# EAGLE schematic ACU rev2 (EAGLE 9.6.2)

## Sheet 1 of 5
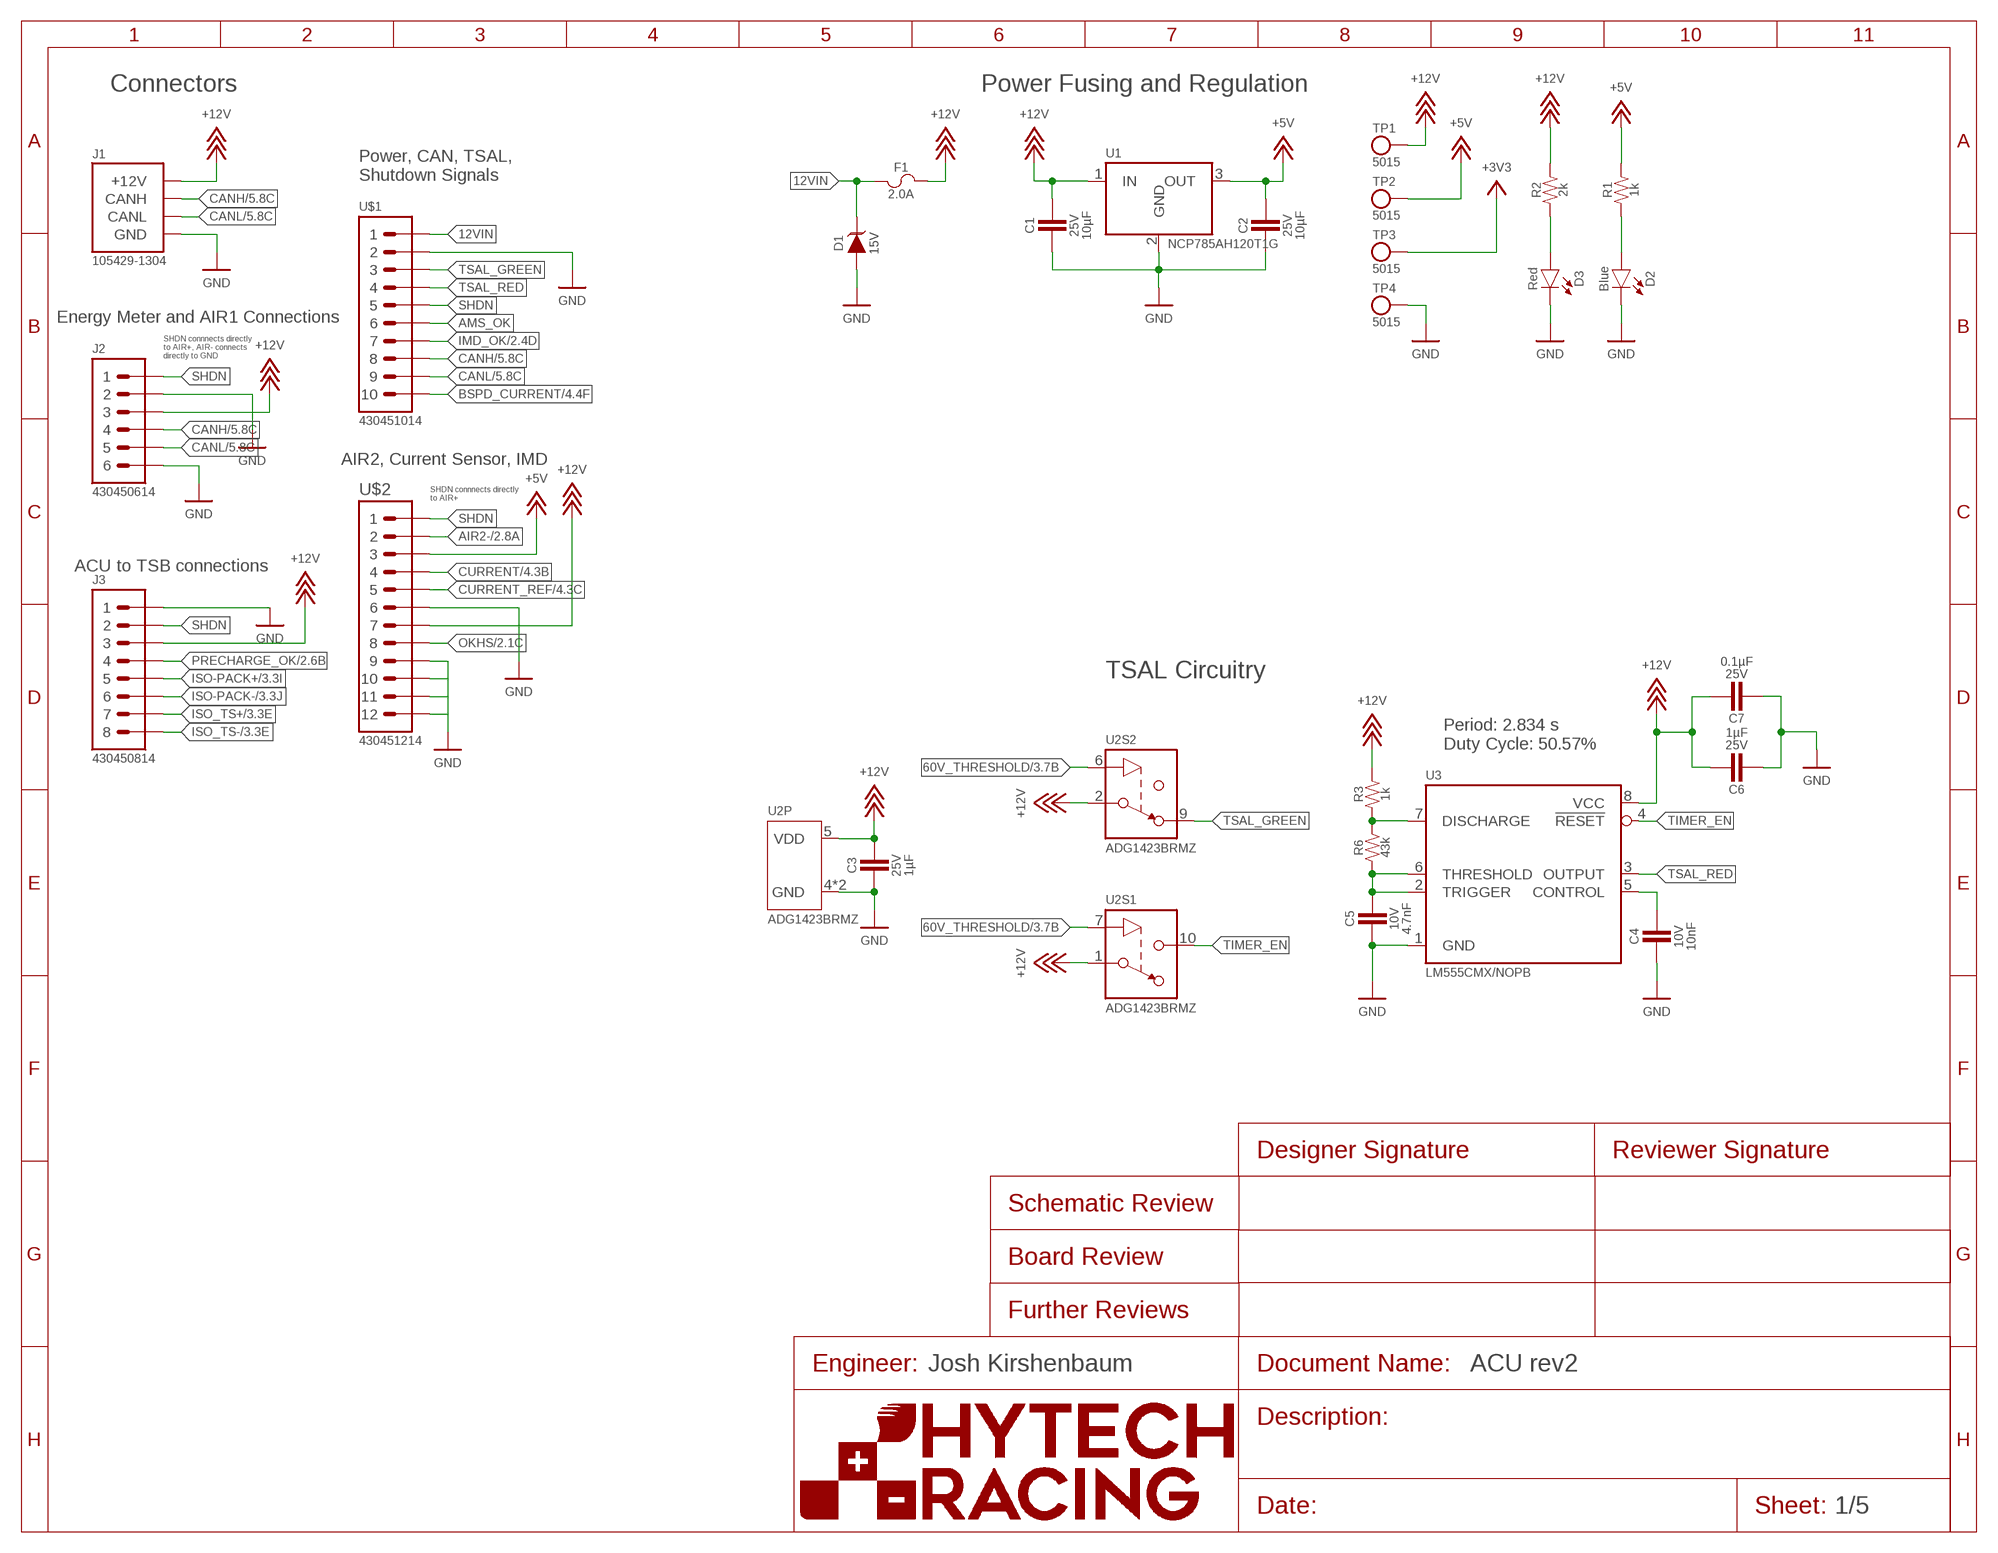
[diagram p0: schematic, sheet 1]

### Parts
C1  CAPACITOR_0603_25V_10UF  [0603-CAP]
C2  CAPACITOR_0603_25V_10UF  [0603-CAP]
C3  CAPACITOR_0603_25V_1UF  [0603-CAP]
C4  CAPACITOR_0603_10V_10NF  [0603-CAP]
C5  CAPACITOR_0603_10V_4.7NF  [0603-CAP]
C6  CAPACITOR_0603_25V_1UF  [0603-CAP]
C7  CAPACITOR_0603_25V_0.1UF  [0603-CAP]
D1  TVS_15V  [SOT-23]
D2  LED_0603_BLUE  [0603-LED]
D3  LED_0603_RED  [0603-LED]
F1  FUSE_0885_2.0  [0885]
J1  CONNECTOR-CAN_NF_T_V_BLACK  [MOLEX_NANOFIT_PTH_04]
J2  CONNECTOR-6_MF_T_V_  [MOLEX_MICROFIT_PTH_VERTICAL_06_DUAL]
J3  CONNECTOR-8_MF_T_V_  [MOLEX_MICROFIT_PTH_VERTICAL_08_DUAL]
R1  RESISTOR_0603_1K  [0603-RES]
R2  RESISTOR_0603_2K  [0603-RES]
R3  RESISTOR_0603_1K  [0603-RES]
R6  RESISTOR_0603_43K  [0603-RES]
TP1  TEST_POINT  [MICRO_MINIATURE]
TP2  TEST_POINT  [MICRO_MINIATURE]
TP3  TEST_POINT  [MICRO_MINIATURE]
TP4  TEST_POINT  [MICRO_MINIATURE]
U1  VOLTAGE_REGULATOR_SOT89_12V  [SOT89]
U2  ADG1423  [MSOP-10]
U3  LM555  [SOIC-08(NARROW,0.15")]
U$1  CONNECTOR-10_MF_T_V_  [MOLEX_MICROFIT_PTH_VERTICAL_10_DUAL]
U$2  CONNECTOR-12_MF_T_V_  [MOLEX_MICROFIT_PTH_VERTICAL_12_DUAL]

### Nets
12VIN: D1.3(C) F1.1 U$1.1
60V_THRESHOLD: U2.6(S2:IN) U2.7(S1:IN) ; also sheet 3
+5V: C2.1 R1.2 TP2.1 U1.3(OUT) U$2.3 ; also sheet 3,4,5
+12V: C1.1 C3.1 C6.1 C7.1 F1.2 J1.1(+12V) J2.3 J3.3 R2.2 R3.2 TP1.1 U1.1(IN) U2.1(S1:S) U2.2(S2:S) U2.5(P:VDD) U3.8(VCC) U$2.7 ; also sheet 2,4,5
AIR2-: U$2.2 ; also sheet 2
AMS_OK: U$1.6
BSPD_CURRENT: U$1.10 ; also sheet 4,5
CANH: J1.4(CANH) J2.4 U$1.8 ; also sheet 5
CANL: J1.3(CANL) J2.5 U$1.9 ; also sheet 5
CURRENT: U$2.4 ; also sheet 4
CURRENT_REF: U$2.5 ; also sheet 4
GND: C1.2 C2.2 C3.2 C4.2 C5.2 C6.2 C7.2 D1.1(A) D2.1(C) D3.1(C) J1.2(GND) J2.2 J2.6 J3.1 TP4.1 U1.2(GND) U2.4(P:GND) U2.8(P:GND) U3.1(GND) U$1.2 U$2.6 U$2.9 ; also sheet 2,3,4,5
IMD_OK: U$1.7 ; also sheet 2,5
ISO-PACK+: J3.5 ; also sheet 3
ISO-PACK-: J3.6 ; also sheet 3
ISO_TS+: J3.7 ; also sheet 3
ISO_TS-: J3.8 ; also sheet 3
N$1: D3.2(A) R2.1
N$2: D2.2(A) R1.1
N$3: C5.1 R6.1 U3.2(TRIGGER) U3.6(THRESHOLD)
N$4: TP3.1 ; supply symbol labelled +3V3
N$5: C4.1 U3.5(CONTROL)
N$6: R3.1 R6.2 U3.7(DISCHARGE)
N$19: U$2.12
N$20: U$2.11
N$21: U$2.10
OKHS: U$2.8 ; also sheet 2
PRECHARGE_OK: J3.4 ; also sheet 2,3,5
SHDN: J2.1 J3.2 U$1.5 U$2.1
TIMER_EN: U2.10(S1:D) U3.4(!RESET)
TSAL_GREEN: U2.9(S2:D) U$1.3
TSAL_RED: U3.3(OUTPUT) U$1.4

### Notes on the sheet
- Connectors | Power Fusing and Regulation
- Power, CAN, TSAL, 
  Shutdown Signals
- Energy Meter and AIR1 Connections
- SHDN connnects directly
  to AIR+, AIR- connects
  directly to GND
- AIR2, Current Sensor, IMD
- SHDN connnects directly
  to AIR+
- ACU to TSB connections
- TSAL Circuitry
- Period: 2.834 s
  Duty Cycle: 50.57%
- Josh Kirshenbaum

## Sheet 2 of 5
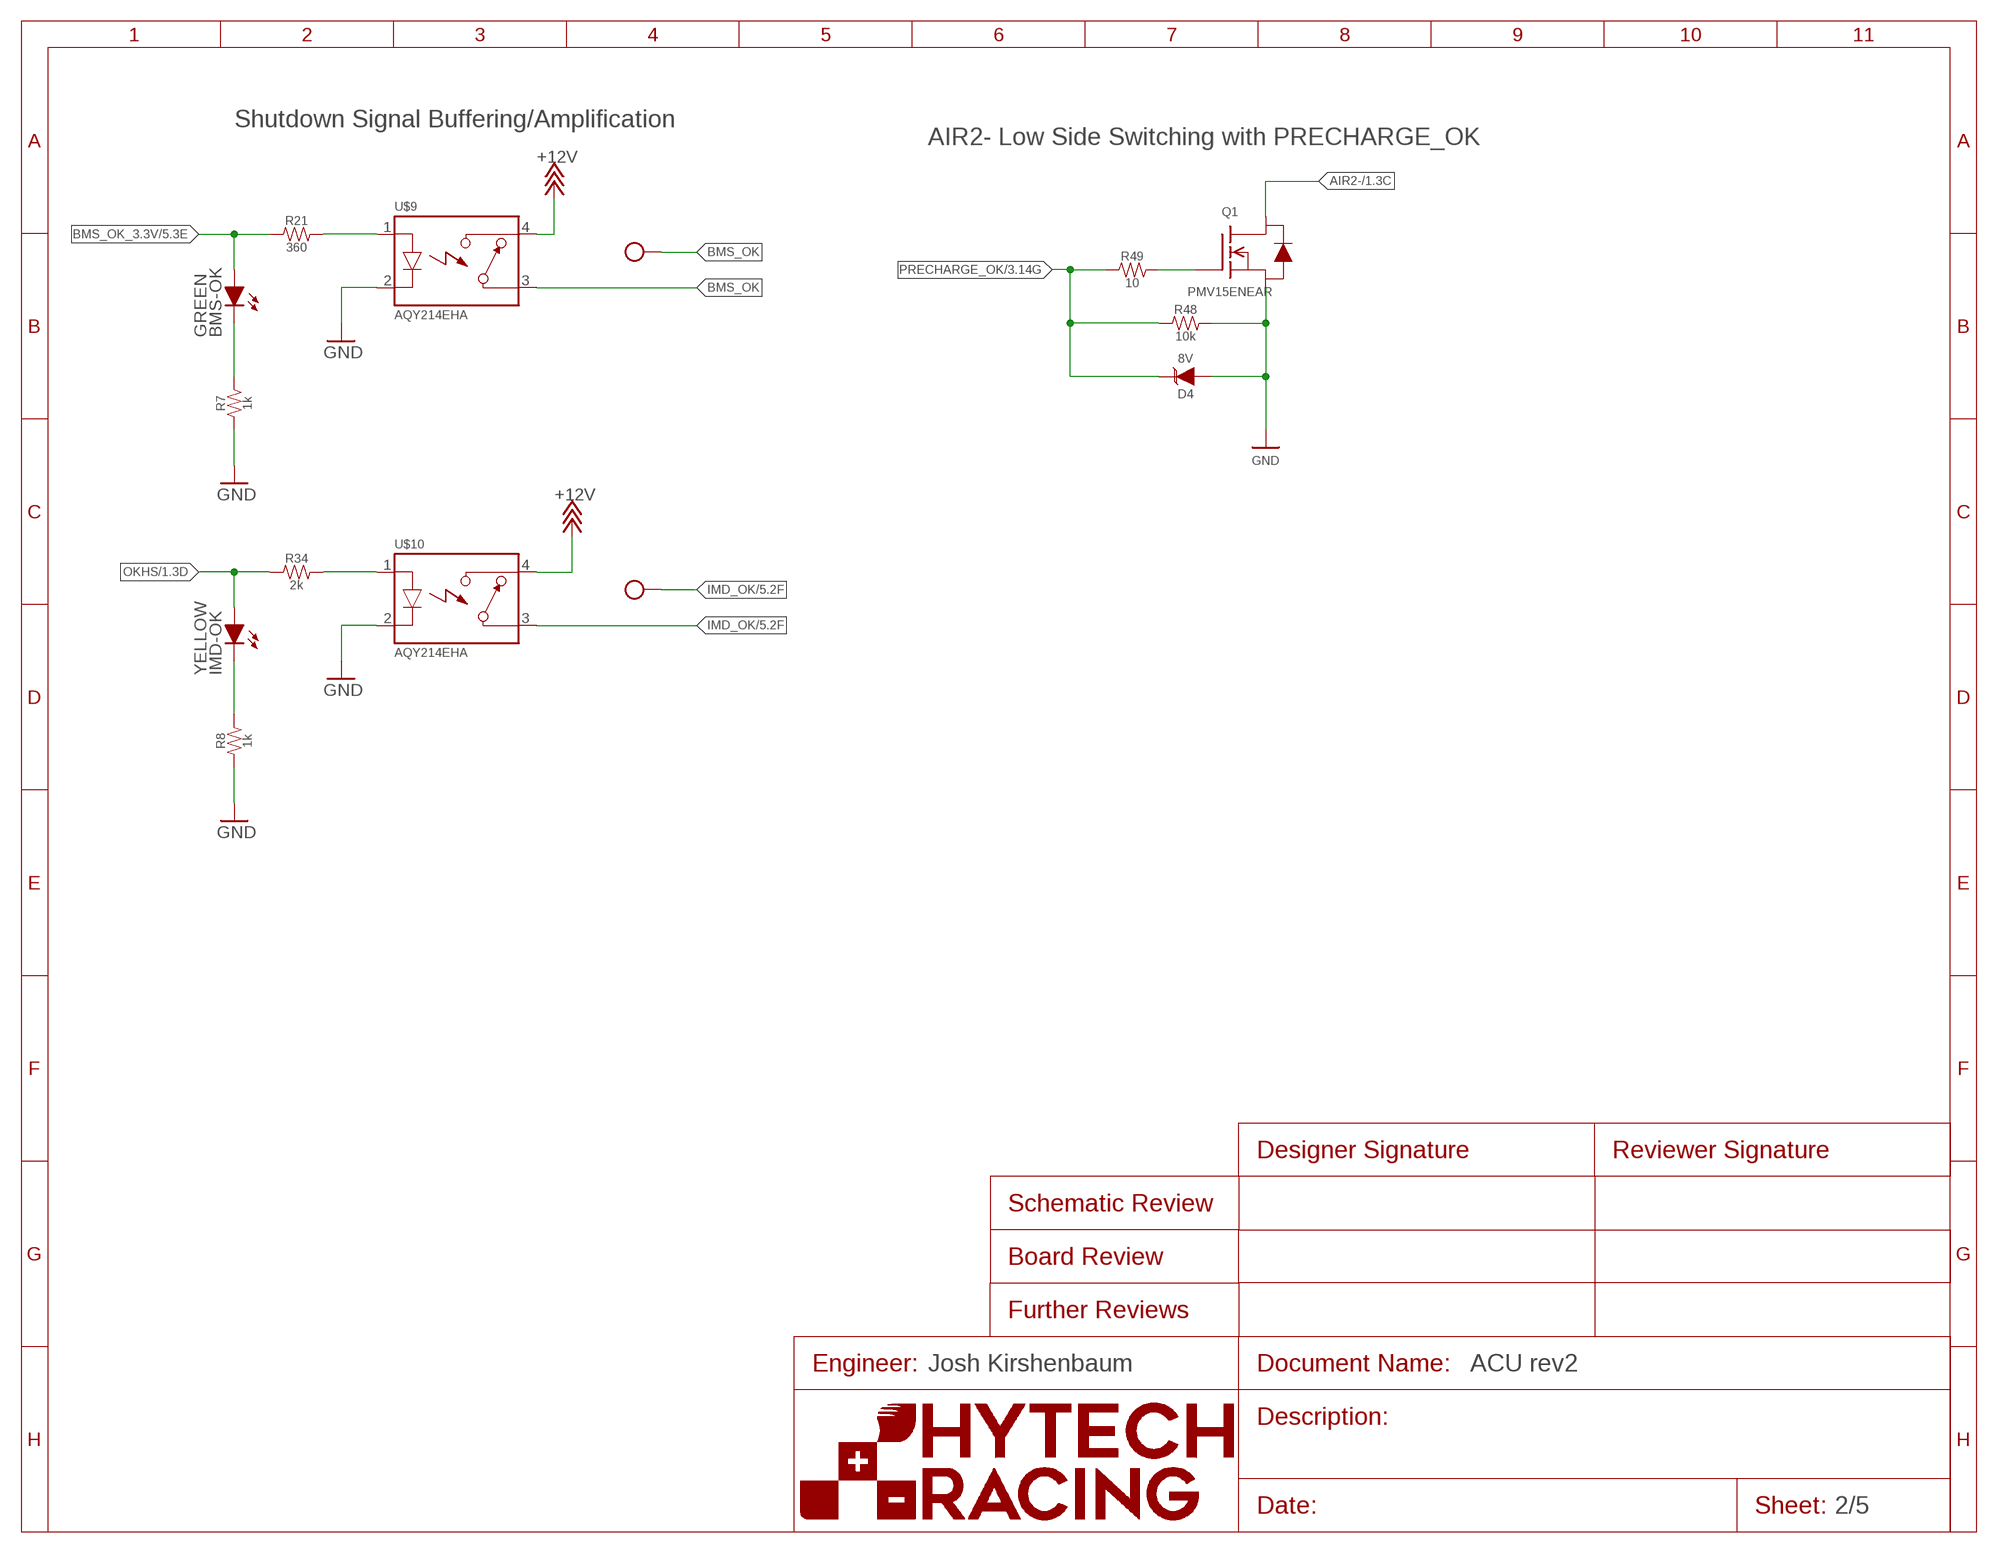
[diagram p1: schematic, sheet 2]

### Parts
$$U$12  TEST_POINTMICRO_MINIATURE  [MICRO_MINIATURE]
BMS-OK  GREEN  LED-0603  [LED-603]
D4  TVS_8V  [SOT-23]
IMD-OK  YELLOW  LED-0603  [LED-603]
Q1  TRANSISTOR_N_MOS__PMV15ENEA  [SOT-23]
R7  RESISTOR_0603_1K  [0603-RES]
R8  RESISTOR_0603_1K  [0603-RES]
R21  RESISTOR_0603_360  [0603-RES]
R34  RESISTOR_0603_2K  [0603-RES]
R48  RESISTOR_0603_10K  [0603-RES]
R49  RESISTOR_0603_10  [0603-RES]
U$9  RELAY_SOLIDSTATE_NO  [ABM3B]
U$10  RELAY_SOLIDSTATE_NO  [ABM3B]
U$13  TEST_POINTMICRO_MINIATURE  [MICRO_MINIATURE]

### Nets
+12V: U$9.4(CONTACT2) U$10.4(CONTACT2) ; also sheet 1,4,5
AIR2-: Q1.3(D) ; also sheet 1
BMS_OK: U$9.3(CONTACT1) U$13.P$1
BMS_OK_3.3V: BMS-OK.A R21.1 ; also sheet 5
GND: D4.1(A) Q1.2(S) R7.1 R8.1 R48.2 U$9.2(CONTROL-) U$10.2(CONTROL-) ; also sheet 1,3,4,5
IMD_OK: $$U$12.P$1 U$10.3(CONTACT1) ; also sheet 1,5
N$7: Q1.1(G) R49.2
N$8: R34.2 U$10.1(CONTROL+)
N$9: IMD-OK.C R8.2
N$16: R21.2 U$9.1(CONTROL+)
N$17: BMS-OK.C R7.2
OKHS: IMD-OK.A R34.1 ; also sheet 1
PRECHARGE_OK: D4.3(C) R48.1 R49.1 ; also sheet 1,3,5

### Notes on the sheet
- Shutdown Signal Buffering/Amplification
- AIR2- Low Side Switching with PRECHARGE_OK
- Josh Kirshenbaum

## Sheet 3 of 5
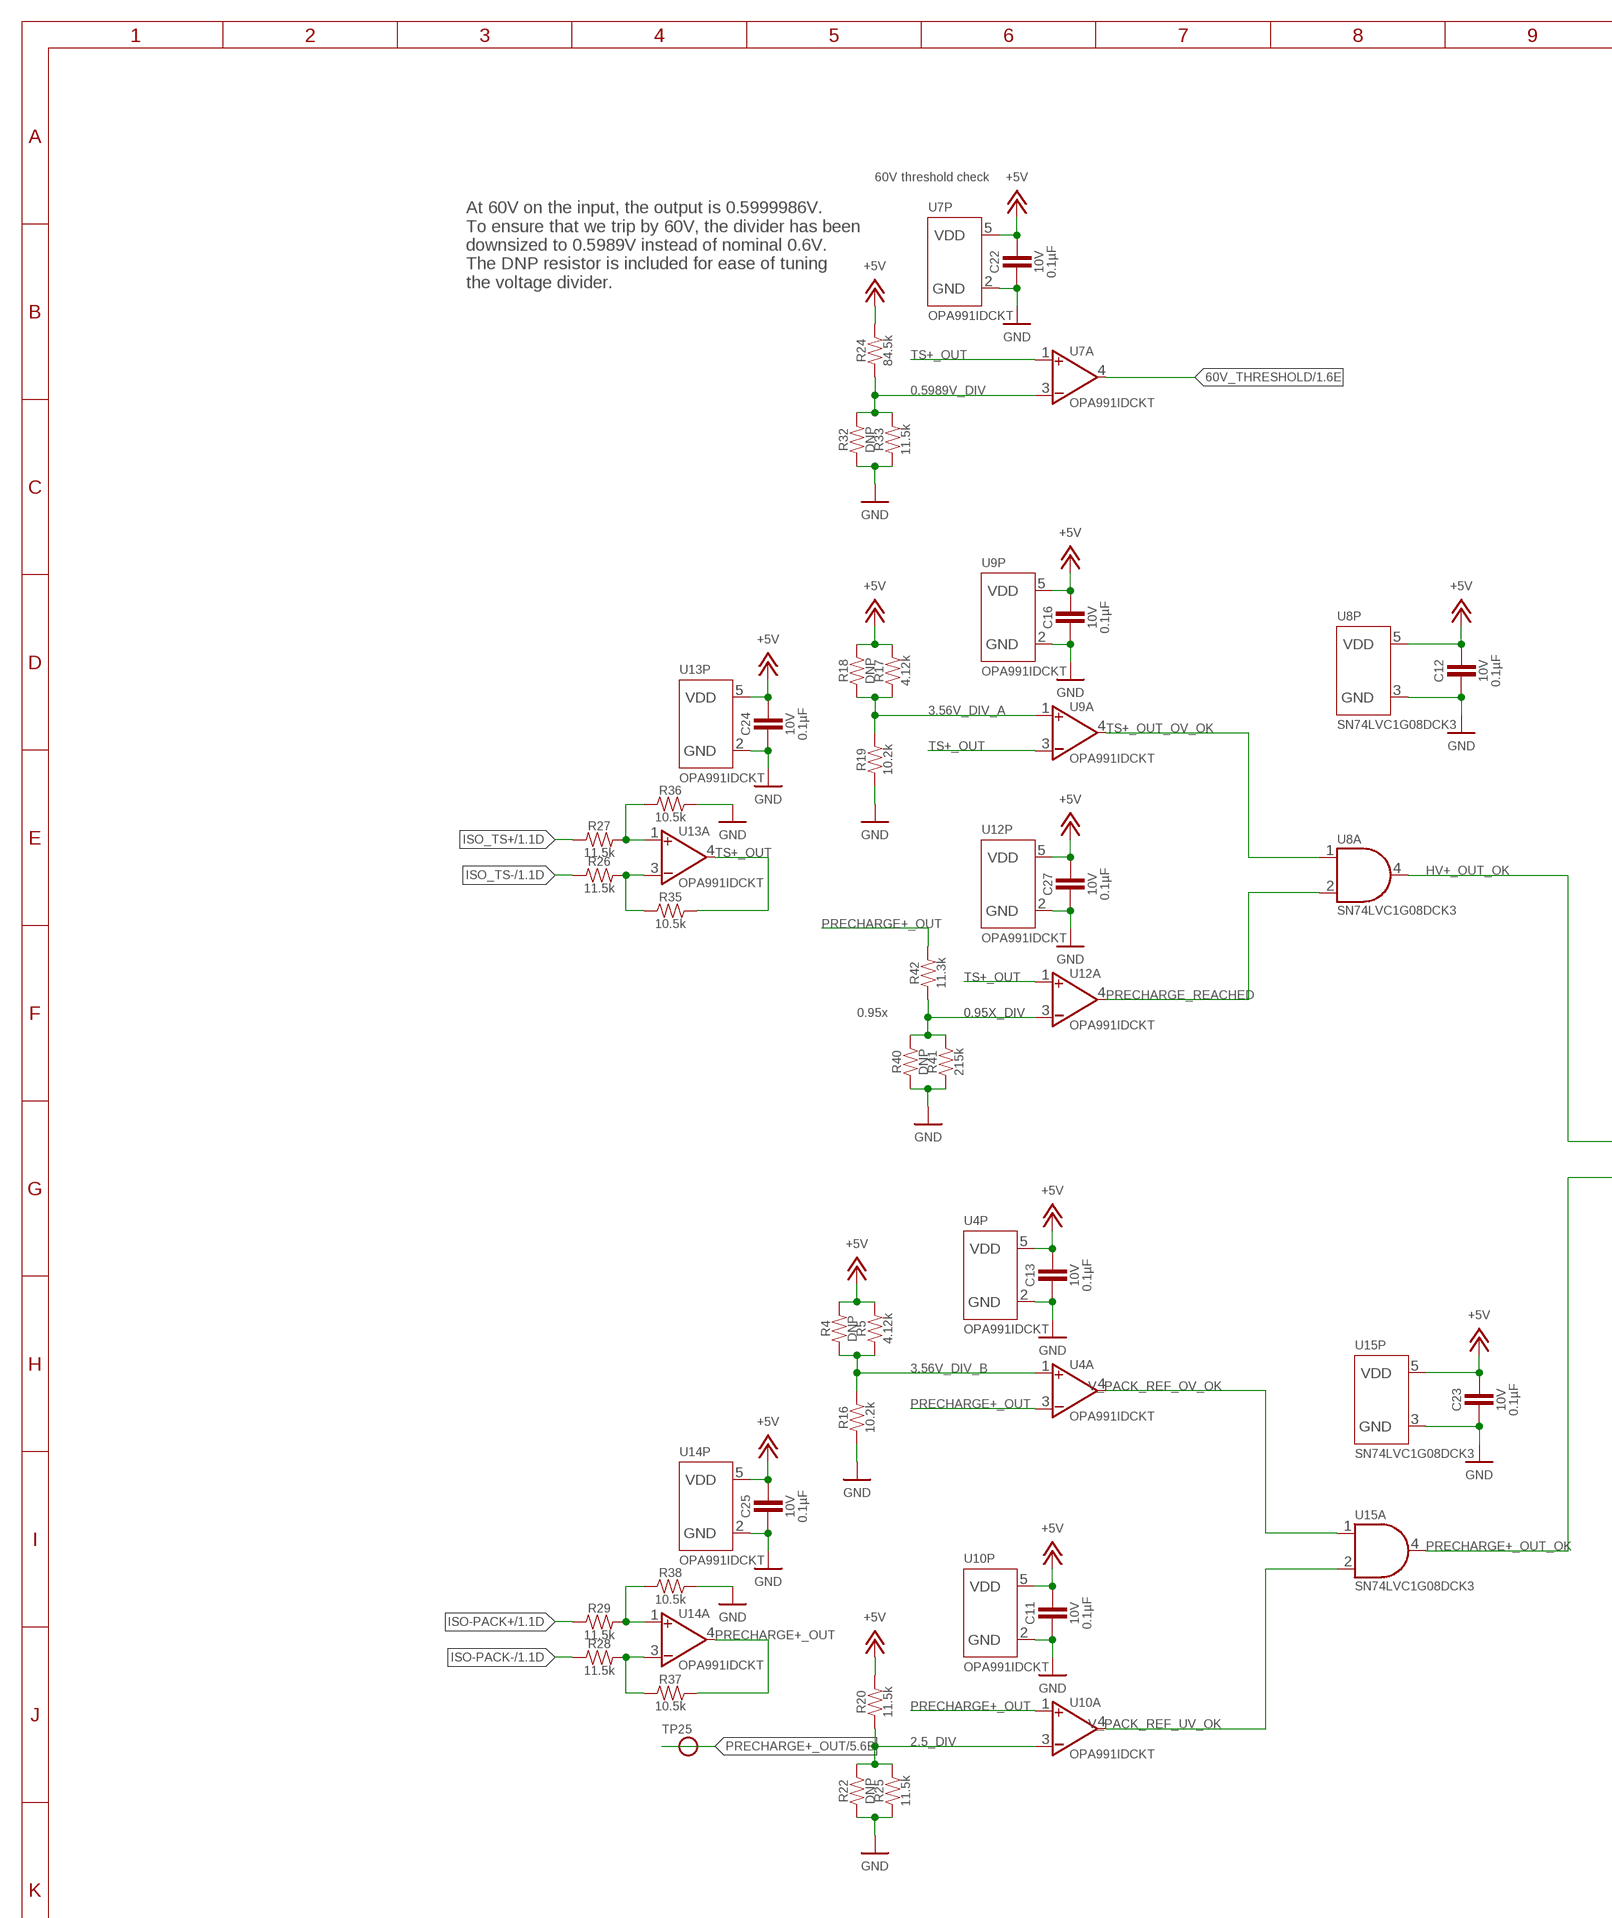
[diagram p2: schematic, sheet 3, part 1 of 2]
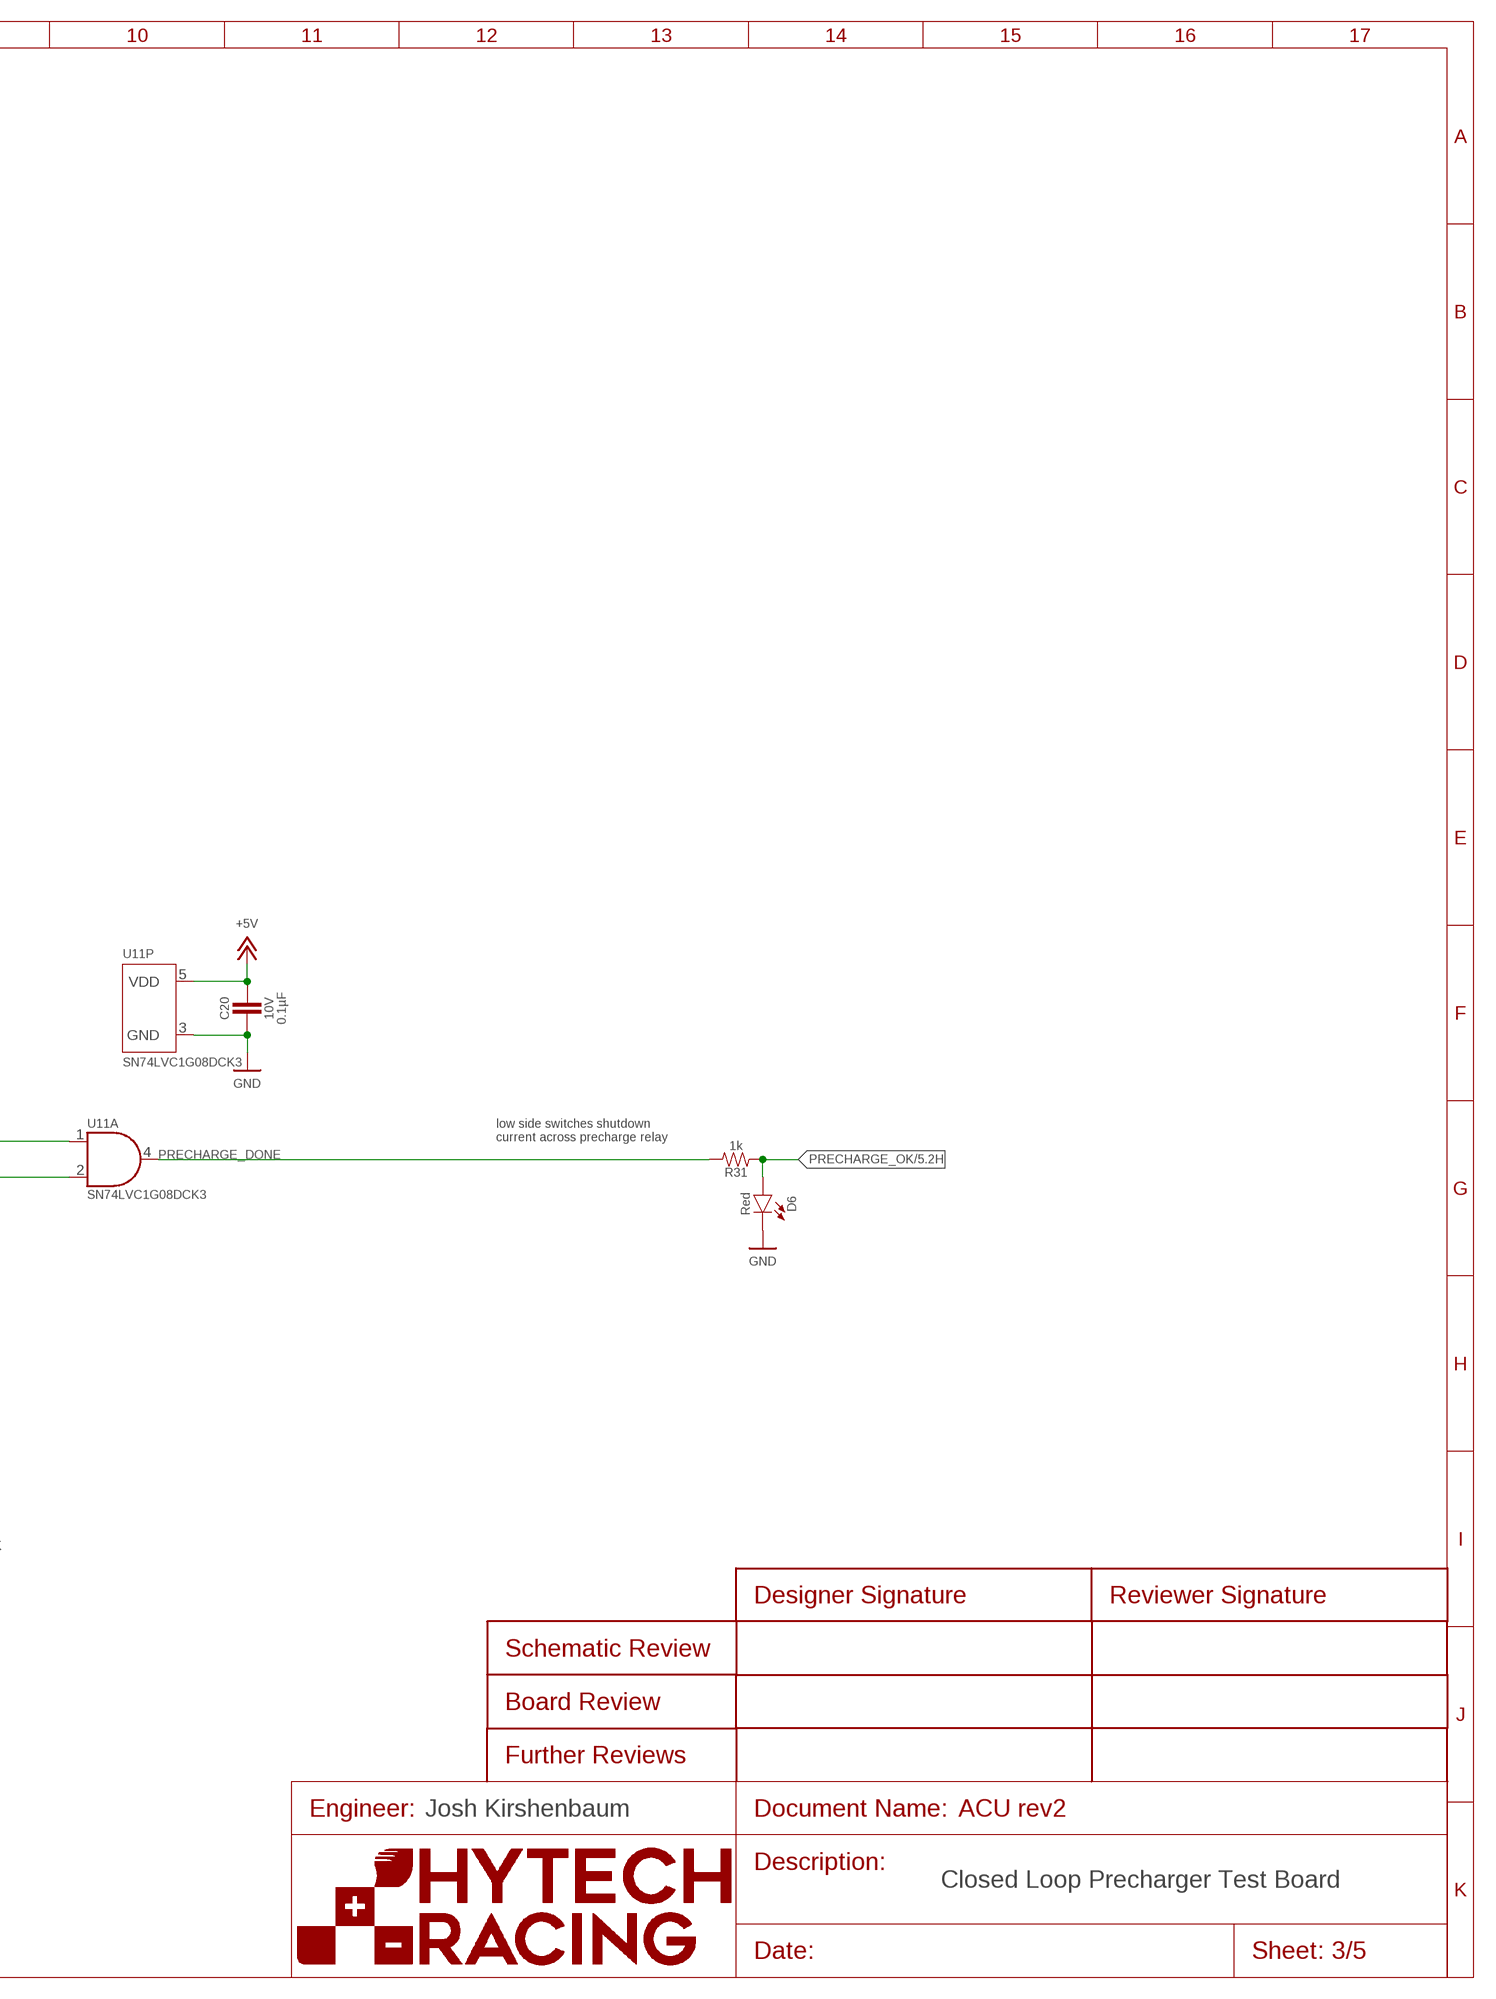
[diagram p3: schematic, sheet 3, part 2 of 2]
U$3 (FRAME_B): FRAME_DESCRIPTION: Default; ORIENTATION: LANDSCAPE; SIZE: B
U$4 (FRAME_B): FRAME_DESCRIPTION: Default; ORIENTATION: LANDSCAPE; SIZE: B

### Parts
C11  CAPACITOR_0603_10V_0.1UF  [0603-CAP]
C12  CAPACITOR_0603_10V_0.1UF  [0603-CAP]
C13  CAPACITOR_0603_10V_0.1UF  [0603-CAP]
C16  CAPACITOR_0603_10V_0.1UF  [0603-CAP]
C20  CAPACITOR_0603_10V_0.1UF  [0603-CAP]
C22  CAPACITOR_0603_10V_0.1UF  [0603-CAP]
C23  CAPACITOR_0603_10V_0.1UF  [0603-CAP]
C24  CAPACITOR_0603_10V_0.1UF  [0603-CAP]
C25  CAPACITOR_0603_10V_0.1UF  [0603-CAP]
C27  CAPACITOR_0603_10V_0.1UF  [0603-CAP]
D6  LED_0603_RED  [0603-LED]
R4  RESISTOR_0603_DNP  [0603-RES]
R5  RESISTOR_0603_4.12K  [0603-RES]
R16  RESISTOR_0603_10.2K  [0603-RES]
R17  RESISTOR_0603_4.12K  [0603-RES]
R18  RESISTOR_0603_DNP  [0603-RES]
R19  RESISTOR_0603_10.2K  [0603-RES]
R20  RESISTOR_0603_11.5K  [0603-RES]
R22  RESISTOR_0603_DNP  [0603-RES]
R24  RESISTOR_0603_84.5K  [0603-RES]
R25  RESISTOR_0603_11.5K  [0603-RES]
R26  RESISTOR_0603_11.5K  [0603-RES]
R27  RESISTOR_0603_11.5K  [0603-RES]
R28  RESISTOR_0603_11.5K  [0603-RES]
R29  RESISTOR_0603_11.5K  [0603-RES]
R31  RESISTOR_0603_1K  [0603-RES]
R32  RESISTOR_0603_DNP  [0603-RES]
R33  RESISTOR_0603_11.5K  [0603-RES]
R35  RESISTOR_0603_10.5K  [0603-RES]
R36  RESISTOR_0603_10.5K  [0603-RES]
R37  RESISTOR_0603_10.5K  [0603-RES]
R38  RESISTOR_0603_10.5K  [0603-RES]
R40  RESISTOR_0603_DNP  [0603-RES]
R41  RESISTOR_0603_215K  [0603-RES]
R42  RESISTOR_0603_11.3K  [0603-RES]
TP25  TEST_POINT  [TEST_POINT]
U4  OPAMP_1_CHANNEL_OPA991  [SC-70-5]
U7  OPAMP_1_CHANNEL_OPA991  [SC-70-5]
U8  LOGICGATE_AND_DCK3  [SC-70-5]
U9  OPAMP_1_CHANNEL_OPA991  [SC-70-5]
U10  OPAMP_1_CHANNEL_OPA991  [SC-70-5]
U11  LOGICGATE_AND_DCK3  [SC-70-5]
U12  OPAMP_1_CHANNEL_OPA991  [SC-70-5]
U13  OPAMP_1_CHANNEL_OPA991  [SC-70-5]
U14  OPAMP_1_CHANNEL_OPA991  [SC-70-5]
U15  LOGICGATE_AND_DCK3  [SC-70-5]

### Nets
0.95X_DIV: R40.2 R41.2 R42.1 U12.3(A:VIN-)
0.5989V_DIV: R24.1 R32.2 R33.2 U7.3(A:VIN-)
2.5_DIV: R20.1 R22.2 R25.2 U10.3(A:VIN-)
3.56V_DIV_A: R17.1 R18.1 R19.2 U9.1(A:VIN+)
3.56V_DIV_B: R4.1 R5.1 R16.2 U4.1(A:VIN+)
60V_THRESHOLD: U7.4(A:VOUT) ; also sheet 1
+5V: C11.1 C12.1 C13.1 C16.1 C20.1 C22.1 C23.1 C24.1 C25.1 C27.1 R4.2 R5.2 R17.2 R18.2 R20.2 R24.2 U4.5(P:VDD) U7.5(P:VDD) U8.5(P:VDD) U9.5(P:VDD) U10.5(P:VDD) U11.5(P:VDD) U12.5(P:VDD) U13.5(P:VDD) U14.5(P:VDD) U15.5(P:VDD) ; also sheet 1,4,5
GND: C11.2 C12.2 C13.2 C16.2 C20.2 C22.2 C23.2 C24.2 C25.2 C27.2 D6.1(C) R16.1 R19.1 R22.1 R25.1 R32.1 R33.1 R36.2 R38.2 R40.1 R41.1 U4.2(P:GND) U7.2(P:GND) U8.3(P:GND) U9.2(P:GND) U10.2(P:GND) U11.3(P:GND) U12.2(P:GND) U13.2(P:GND) U14.2(P:GND) U15.3(P:GND) ; also sheet 1,2,4,5
HV+_OUT_OK: U8.4(A:OUT) U11.1(A:IN1)
ISO-PACK+: R29.1 ; also sheet 1
ISO-PACK-: R28.1 ; also sheet 1
ISO_TS+: R27.1 ; also sheet 1
ISO_TS-: R26.1 ; also sheet 1
N$10: R27.2 R36.1 U13.1(A:VIN+)
N$11: R26.2 R35.1 U13.3(A:VIN-)
N$22: R29.2 R38.1 U14.1(A:VIN+)
N$23: R28.2 R37.1 U14.3(A:VIN-)
PRECHARGE+_OUT: R37.2 R42.2 TP25.P$1 U4.3(A:VIN-) U10.1(A:VIN+) U14.4(A:VOUT) ; also sheet 5
PRECHARGE+_OUT_OK: U11.2(A:IN2) U15.4(A:OUT)
PRECHARGE_DONE: R31.2 U11.4(A:OUT)
PRECHARGE_OK: D6.2(A) R31.1 ; also sheet 1,2,5
PRECHARGE_REACHED: U8.2(A:IN2) U12.4(A:VOUT)
TS+_OUT: R35.2 U7.1(A:VIN+) U9.3(A:VIN-) U12.1(A:VIN+) U13.4(A:VOUT) ; also sheet 5
TS+_OUT_OV_OK: U8.1(A:IN1) U9.4(A:VOUT)
V_PACK_REF_OV_OK: U4.4(A:VOUT) U15.1(A:IN1)
V_PACK_REF_UV_OK: U10.4(A:VOUT) U15.2(A:IN2)

### Notes on the sheet
- 60V threshold check
- At 60V on the input, the output is 0.5999986V.
  To ensure that we trip by 60V, the divider has been
  downsized to 0.5989V instead of nominal 0.6V.
  The DNP resistor is included for ease of tuning
  the voltage divider.
- 0.95x
- low side switches shutdown 
  current across precharge relay
- Josh Kirshenbaum
- Closed Loop Precharger Test Board

## Sheet 4 of 5
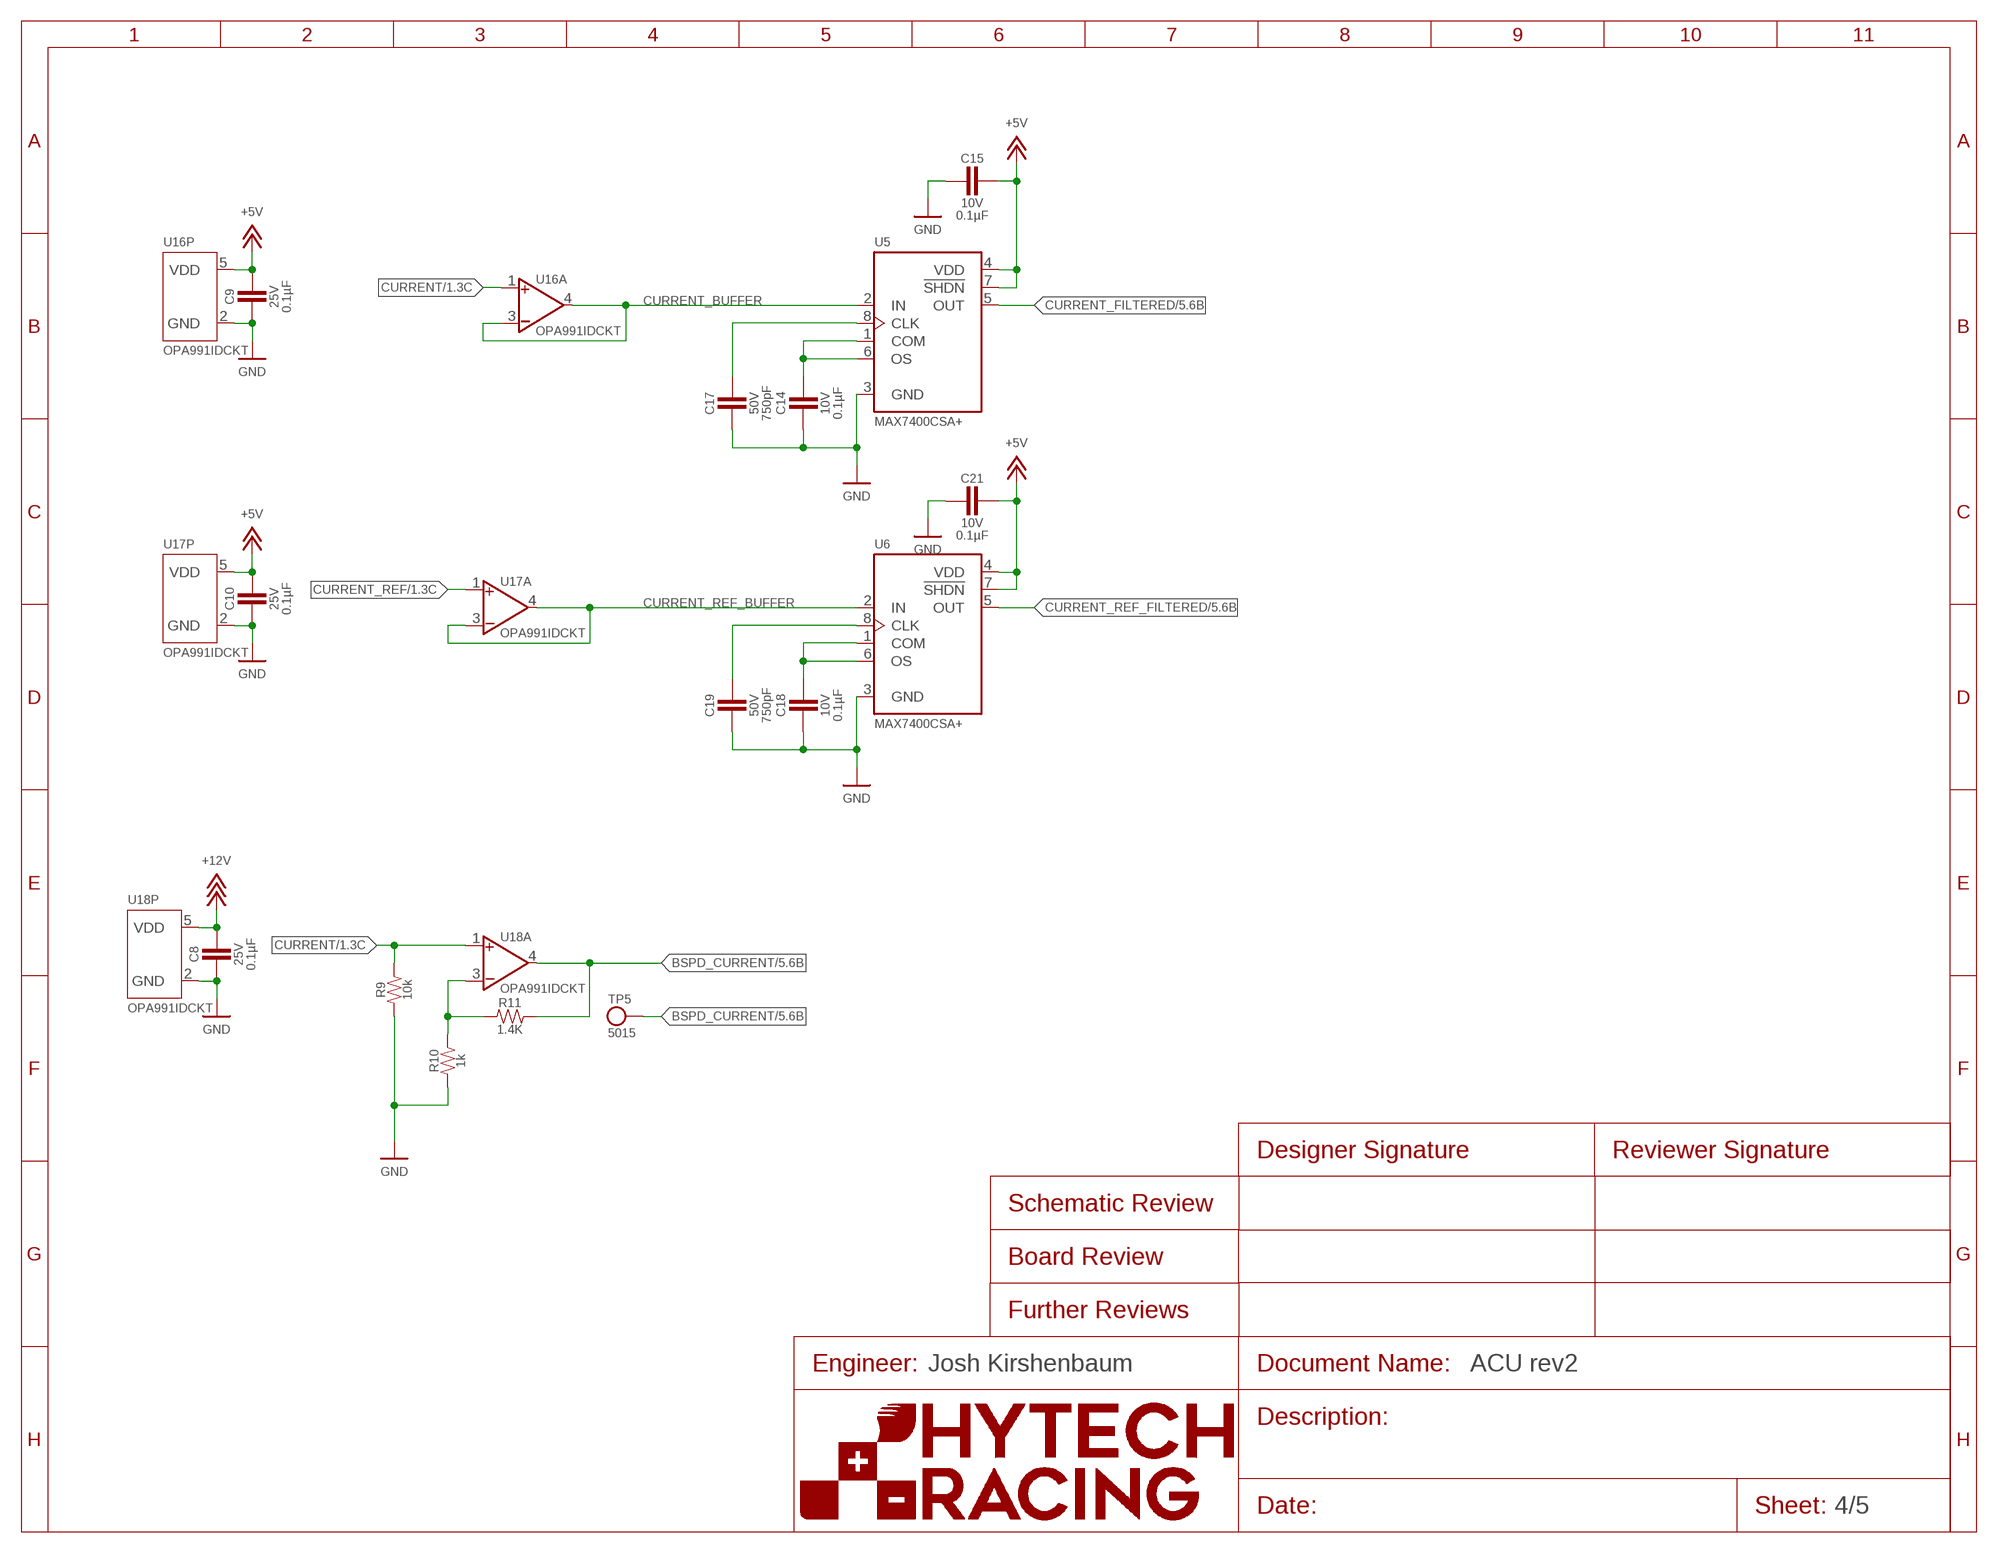
[diagram p4: schematic, sheet 4]

### Parts
C8  CAPACITOR_0603_25V_0.1UF  [0603-CAP]
C9  CAPACITOR_0603_25V_0.1UF  [0603-CAP]
C10  CAPACITOR_0603_25V_0.1UF  [0603-CAP]
C14  CAPACITOR_0603_10V_0.1UF  [0603-CAP]
C15  CAPACITOR_0603_10V_0.1UF  [0603-CAP]
C17  CAPACITOR_0603_50V_750PF  [0603-CAP]
C18  CAPACITOR_0603_10V_0.1UF  [0603-CAP]
C19  CAPACITOR_0603_50V_750PF  [0603-CAP]
C21  CAPACITOR_0603_10V_0.1UF  [0603-CAP]
R9  RESISTOR_0603_10K  [0603-RES]
R10  RESISTOR_0603_1K  [0603-RES]
R11  RESISTOR_0603_1.4K  [0603-RES]
TP5  TEST_POINT  [MICRO_MINIATURE]
U5  MAX7400  [SOIC-08(NARROW,0.15")]
U6  MAX7400  [SOIC-08(NARROW,0.15")]
U16  OPAMP_1_CHANNEL_OPA991  [SC-70-5]
U17  OPAMP_1_CHANNEL_OPA991  [SC-70-5]
U18  OPAMP_1_CHANNEL_OPA991  [SC-70-5]

### Nets
+5V: C9.1 C10.1 C15.1 C21.1 U5.4(VDD) U5.7(!SHDN) U6.4(VDD) U6.7(!SHDN) U16.5(P:VDD) U17.5(P:VDD) ; also sheet 1,3,5
+12V: C8.1 U18.5(P:VDD) ; also sheet 1,2,5
BSPD_CURRENT: R11.2 TP5.1 U18.4(A:VOUT) ; also sheet 1,5
CURRENT: R9.2 U16.1(A:VIN+) U18.1(A:VIN+) ; also sheet 1
CURRENT_BUFFER: U5.2(IN) U16.3(A:VIN-) U16.4(A:VOUT)
CURRENT_FILTERED: U5.5(OUT) ; also sheet 5
CURRENT_REF: U17.1(A:VIN+) ; also sheet 1
CURRENT_REF_BUFFER: U6.2(IN) U17.3(A:VIN-) U17.4(A:VOUT)
CURRENT_REF_FILTERED: U6.5(OUT) ; also sheet 5
GND: C8.2 C9.2 C10.2 C14.2 C15.2 C17.2 C18.2 C19.2 C21.2 R9.1 R10.1 U5.3(GND) U6.3(GND) U16.2(P:GND) U17.2(P:GND) U18.2(P:GND) ; also sheet 1,2,3,5
N$12: R10.2 R11.1 U18.3(A:VIN-)
N$13: C14.1 U5.1(COM) U5.6(OS)
N$14: C17.1 U5.8(CLK)
N$15: C18.1 U6.1(COM) U6.6(OS)
N$18: C19.1 U6.8(CLK)

### Notes on the sheet
- Josh Kirshenbaum

## Sheet 5 of 5
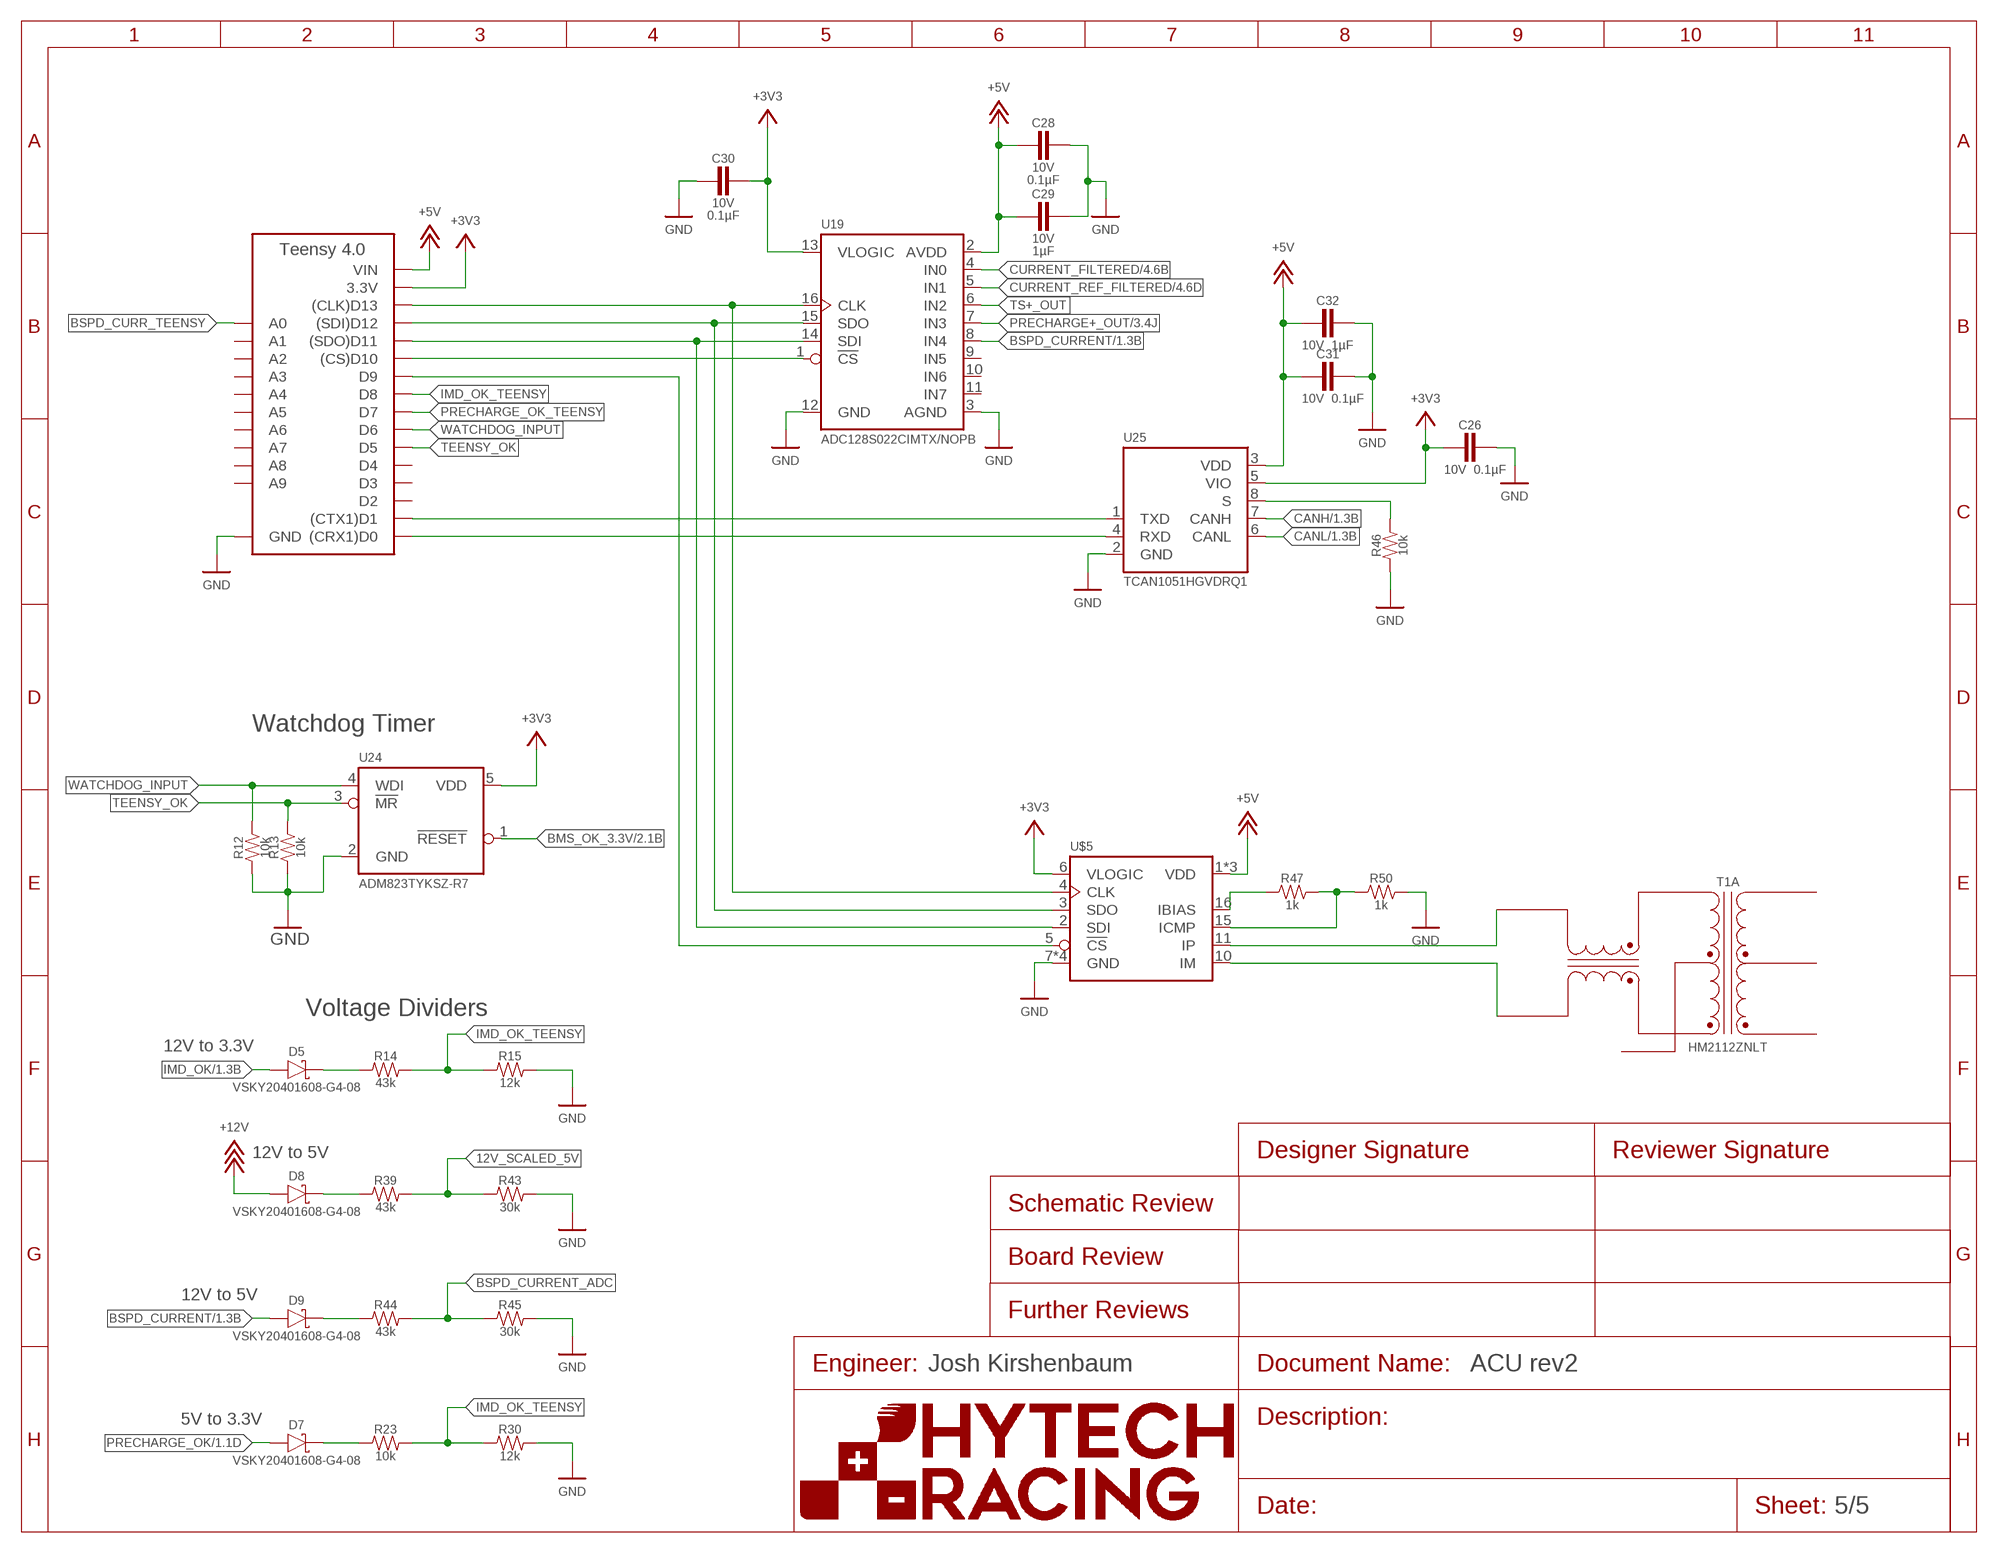
[diagram p5: schematic, sheet 5]

### Parts
A1  TEENSY_4.0  [TEENSY_SHORT]
C26  CAPACITOR_0603_10V_0.1UF  [0603-CAP]
C28  CAPACITOR_0603_10V_0.1UF  [0603-CAP]
C29  CAPACITOR_0603_10V_1UF  [0603-CAP]
C30  CAPACITOR_0603_10V_0.1UF  [0603-CAP]
C31  CAPACITOR_0603_10V_0.1UF  [0603-CAP]
C32  CAPACITOR_0603_10V_1UF  [0603-CAP]
D5  SCHOTTKY  [CLP1608-2L]
D7  SCHOTTKY  [CLP1608-2L]
D8  SCHOTTKY  [CLP1608-2L]
D9  SCHOTTKY  [CLP1608-2L]
R12  RESISTOR_0603_10K  [0603-RES]
R13  RESISTOR_0603_10K  [0603-RES]
R14  RESISTOR_0603_43K  [0603-RES]
R15  RESISTOR_0603_12K  [0603-RES]
R23  RESISTOR_0603_10K  [0603-RES]
R30  RESISTOR_0603_12K  [0603-RES]
R39  RESISTOR_0603_43K  [0603-RES]
R43  RESISTOR_0603_30K  [0603-RES]
R44  RESISTOR_0603_43K  [0603-RES]
R45  RESISTOR_0603_30K  [0603-RES]
R46  RESISTOR_0603_10K  [0603-RES]
R47  RESISTOR_0603_1K  [0603-RES]
R50  RESISTOR_0603_1K  [0603-RES]
T1  TRANSFORMER_HM2112ZNLT_AIRGAP  [HM2112ZNLT_AIRGAP]
U19  ADC128S022  [TSSOP-16]
U24  ADM823  [SC-70-5]
U25  TCAN1051HQV-Q1  [SOIC-08(NARROW,0.15")]
U$5  LTC6820  [MSOP-16]

### Nets
12V_SCALED_5V: R39.2 R43.1
+3V3: A1.3.3V C26.2 C30.1 U19.13(VLOGIC) U24.5(VDD) U25.5(VIO) U$5.6(VLOGIC)
+5V: A1.VIN C28.2 C29.2 C31.2 C32.2 U19.2(AVDD) U25.3(VDD) U$5.1(VDD) U$5.9(VDD) U$5.12(VDD) ; also sheet 1,3,4
+12V: D8.1(A) ; also sheet 1,2,4
BMS_OK_3.3V: U24.1(!RESET!) ; also sheet 2
BSPD_CURR_TEENSY: A1.D14(A0)
BSPD_CURRENT: D9.1(A) U19.8(IN4) ; also sheet 1,4
BSPD_CURRENT_ADC: R44.2 R45.1
CANH: U25.7(CANH) ; also sheet 1
CANL: U25.6(CANL) ; also sheet 1
CS_LTC_6820: A1.D9 U$5.5(!CS)
CURRENT_FILTERED: U19.4(IN0) ; also sheet 4
CURRENT_REF_FILTERED: U19.5(IN1) ; also sheet 4
GND: A1.AGND/GND(GND) A1.GND C26.1 C28.1 C29.1 C30.2 C31.1 C32.1 R12.1 R13.1 R15.2 R30.2 R43.2 R45.2 R46.1 R50.2 U19.3(AGND) U19.12(GND) U24.2(GND) U25.2(GND) U$5.7(GND) U$5.8(GND) U$5.13(GND) U$5.14(GND) ; also sheet 1,2,3,4
IMD_OK: D5.1(A) ; also sheet 1,2
IMD_OK_TEENSY: A1.D8 R14.2 R15.1 R23.2 R30.1
N$24: A1.D1((CTX1)D1) U25.1(TXD)
N$25: A1.D0((CRX1)D0) U25.4(RXD)
N$26: R46.2 U25.8(S)
N$27: A1.D13((CLK)D13) U19.16(CLK) U$5.4(CLK)
N$28: A1.D12((SDI)D12) U19.15(SDO) U$5.3(SDO)
N$29: A1.D11((SDO)D11) U19.14(SDI) U$5.2(SDI)
N$30: A1.D10((CS)D10) U19.1(!CS!)
N$31: D7.2(C) R23.1
N$32: D5.2(C) R14.1
N$33: D8.2(C) R39.1
N$34: D9.2(C) R44.1
N$35: T1.10(A:TD-) U$5.11(IP)
N$36: R47.1 U$5.16(IBIAS)
N$37: R47.2 R50.1 U$5.15(ICMP)
N$38: T1.12(A:TD+) U$5.10(IM)
PRECHARGE+_OUT: U19.7(IN3) ; also sheet 3
PRECHARGE_OK: D7.1(A) ; also sheet 1,2,3
PRECHARGE_OK_TEENSY: A1.D7
TEENSY_OK: A1.D5 R13.2 U24.3(!MR!)
TS+_OUT: U19.6(IN2) ; also sheet 3
WATCHDOG_INPUT: A1.D6 R12.2 U24.4(WDI)
Unconnected: A1.D2 A1.D3 A1.D4 A1.D15(A1) A1.D16(A2) A1.D17(A3) A1.D18(A4) A1.D19(A5) A1.D20(A6) A1.D21(A7) A1.D22(A8) A1.D23(A9) T1.1(A:MX+) T1.2(A:MCT) T1.3(A:MX-) T1.4(B:MX+) T1.5(B:MCT) T1.6(B:MX-) T1.7(B:TD-) T1.8(B:TCT) T1.9(B:TD+) T1.11(A:TCT) U19.9(IN5) U19.10(IN6) U19.11(IN7)

### Notes on the sheet
- Watchdog Timer
- Voltage Dividers
- 12V to 3.3V
- 12V to 5V
- 12V to 5V
- Josh Kirshenbaum
- 5V to 3.3V

## Library data of the parts
$$U$12 TP25 U$13 = HyTechDevices:TEST_POINT: Keystone Electronics Test Point 5005
A1 = HyTechDevices:TEENSY_4.0: Teensy 4.0 Datasheet <https://www.pjrc.com/store/teensy40.html>
BMS-OK IMD-OK = HyTechDevices:LED: Light Emitting Diode (LED) Source: Dangerous Prototypes Eagle Library <https://github.com/DangerousPrototypes/Eagle_Part_Library>
C1 C2 = HyTechDevices:CAPACITOR_?_*: Capacitor, Non-Polarized VJ...1BC Series Datasheet <https://www.mouser.com/datasheet/2/427/vjw1bcbascomseries-1762447.pdf> Samsung Datasheet <https://www.mouser.com/datasheet/2/585/MLCC-1837944.pdf> Walsin Datasheet <https://www.mouser.com/datasheet/2/210/WTC_MLCC_General_Purpose-1534899.pdf> GRM188R61A226ME15D <https://www.mouser.com/datasheet/2/281/1/GRM188R61A226ME15_02A-1985787.pdf> GRM188R61E106MA73D <https://www.mouser.com/datasheet/2/281/1/GRM188R61E106MA73_01A-1985806.pdf> 885012006013 <https://www.mouser.com/datasheet/2/445/885012006013-1726946.pdf> 2220Y6300105KXTWS2 <https://www.mouser.com/datasheet/2/218/SMD_High_and_Std_StackiCap_P62-1825512.pdf> Yageo Class 2, X5R <https://www.mouser.com/datasheet/2/447/UPY_GPHC_X5R_4V_to_50V_26-1827097.pdf> TDK C Series <https://www.mouser.com/ProductDetail/TDK/C3216X5R1V226M160AC?qs=%2Fha2pyFadujbcx9jh7lYl%2F4NeMoXFhdc8AqVWNq4wW6M2y7zl6GzBuhgtI0ngznN> AVX Automotive MLCC <https://www.mouser.com/datasheet/2/40/AutoMLCC-777028.pdf> KEMET X7R Series <https://www.mouser.com/datasheet/2/212/KEM_C1002_X7R_SMD-1102033.pdf>; CAPACITANCE: 10µF; DKPN: 490-7202-1-ND; MANUFACTURER: Murata Electronics; MOPN: 81-GRM188R61E106MA3D; MPN: GRM188R61E106MA73D; TOLERANCE: 20%; VOLTAGE: 25V
C3 = HyTechDevices:CAPACITOR_?_*: Capacitor, Non-Polarized VJ...1BC Series Datasheet <https://www.mouser.com/datasheet/2/427/vjw1bcbascomseries-1762447.pdf> Samsung Datasheet <https://www.mouser.com/datasheet/2/585/MLCC-1837944.pdf> Walsin Datasheet <https://www.mouser.com/datasheet/2/210/WTC_MLCC_General_Purpose-1534899.pdf> GRM188R61A226ME15D <https://www.mouser.com/datasheet/2/281/1/GRM188R61A226ME15_02A-1985787.pdf> GRM188R61E106MA73D <https://www.mouser.com/datasheet/2/281/1/GRM188R61E106MA73_01A-1985806.pdf> 885012006013 <https://www.mouser.com/datasheet/2/445/885012006013-1726946.pdf> 2220Y6300105KXTWS2 <https://www.mouser.com/datasheet/2/218/SMD_High_and_Std_StackiCap_P62-1825512.pdf> Yageo Class 2, X5R <https://www.mouser.com/datasheet/2/447/UPY_GPHC_X5R_4V_to_50V_26-1827097.pdf> TDK C Series <https://www.mouser.com/ProductDetail/TDK/C3216X5R1V226M160AC?qs=%2Fha2pyFadujbcx9jh7lYl%2F4NeMoXFhdc8AqVWNq4wW6M2y7zl6GzBuhgtI0ngznN> AVX Automotive MLCC <https://www.mouser.com/datasheet/2/40/AutoMLCC-777028.pdf> KEMET X7R Series <https://www.mouser.com/datasheet/2/212/KEM_C1002_X7R_SMD-1102033.pdf>; CAPACITANCE: 1µF; DKPN: 1276-1184-1-ND; MANUFACTURER: Samsung Electro-Mechanics; MOPN: 187-CL10B105KA8NNNC; MPN: CL10B105KA8NNNC; TOLERANCE: 10%; VOLTAGE: 25V
C4 = HyTechDevices - Copy:CAPACITOR_?_*: Capacitor, Non-Polarized VJ...1BC Series Datasheet <https://www.mouser.com/datasheet/2/427/vjw1bcbascomseries-1762447.pdf> Samsung Datasheet <https://www.mouser.com/datasheet/2/585/MLCC-1837944.pdf> Walsin Datasheet <https://www.mouser.com/datasheet/2/210/WTC_MLCC_General_Purpose-1534899.pdf> GRM188R61A226ME15D <https://www.mouser.com/datasheet/2/281/1/GRM188R61A226ME15_02A-1985787.pdf> GRM188R61E106MA73D <https://www.mouser.com/datasheet/2/281/1/GRM188R61E106MA73_01A-1985806.pdf> 885012006013 <https://www.mouser.com/datasheet/2/445/885012006013-1726946.pdf> 2220Y6300105KXTWS2 <https://www.mouser.com/datasheet/2/218/SMD_High_and_Std_StackiCap_P62-1825512.pdf> Yageo Class 2, X5R <https://www.mouser.com/datasheet/2/447/UPY_GPHC_X5R_4V_to_50V_26-1827097.pdf> TDK C Series <https://www.mouser.com/ProductDetail/TDK/C3216X5R1V226M160AC?qs=%2Fha2pyFadujbcx9jh7lYl%2F4NeMoXFhdc8AqVWNq4wW6M2y7zl6GzBuhgtI0ngznN> AVX Automotive MLCC <https://www.mouser.com/datasheet/2/40/AutoMLCC-777028.pdf> KEMET X7R Series <https://www.mouser.com/datasheet/2/212/KEM_C1002_X7R_SMD-1102033.pdf>; CAPACITANCE: 10nF; DKPN: 311-4054-1-ND; MANUFACTURER: Yageo; MOPN: 603-CC603KRX7R6BB103; MPN: CC0603KRX7R6BB103; TOLERANCE: 10%; VOLTAGE: 10V
C5 = HyTechDevices - Copy:CAPACITOR_?_*: Capacitor, Non-Polarized VJ...1BC Series Datasheet <https://www.mouser.com/datasheet/2/427/vjw1bcbascomseries-1762447.pdf> Samsung Datasheet <https://www.mouser.com/datasheet/2/585/MLCC-1837944.pdf> Walsin Datasheet <https://www.mouser.com/datasheet/2/210/WTC_MLCC_General_Purpose-1534899.pdf> GRM188R61A226ME15D <https://www.mouser.com/datasheet/2/281/1/GRM188R61A226ME15_02A-1985787.pdf> GRM188R61E106MA73D <https://www.mouser.com/datasheet/2/281/1/GRM188R61E106MA73_01A-1985806.pdf> 885012006013 <https://www.mouser.com/datasheet/2/445/885012006013-1726946.pdf> 2220Y6300105KXTWS2 <https://www.mouser.com/datasheet/2/218/SMD_High_and_Std_StackiCap_P62-1825512.pdf> Yageo Class 2, X5R <https://www.mouser.com/datasheet/2/447/UPY_GPHC_X5R_4V_to_50V_26-1827097.pdf> TDK C Series <https://www.mouser.com/ProductDetail/TDK/C3216X5R1V226M160AC?qs=%2Fha2pyFadujbcx9jh7lYl%2F4NeMoXFhdc8AqVWNq4wW6M2y7zl6GzBuhgtI0ngznN> AVX Automotive MLCC <https://www.mouser.com/datasheet/2/40/AutoMLCC-777028.pdf> KEMET X7R Series <https://www.mouser.com/datasheet/2/212/KEM_C1002_X7R_SMD-1102033.pdf>; CAPACITANCE: 4.7nF; DKPN: 732-7931-1-ND; MANUFACTURER: Würth Elektronik; MOPN: 710-885012206012; MPN: 885012206012; TOLERANCE: 10%; VOLTAGE: 10V
C6 = HyTechDevices - Copy:CAPACITOR_?_*: Capacitor, Non-Polarized VJ...1BC Series Datasheet <https://www.mouser.com/datasheet/2/427/vjw1bcbascomseries-1762447.pdf> Samsung Datasheet <https://www.mouser.com/datasheet/2/585/MLCC-1837944.pdf> Walsin Datasheet <https://www.mouser.com/datasheet/2/210/WTC_MLCC_General_Purpose-1534899.pdf> GRM188R61A226ME15D <https://www.mouser.com/datasheet/2/281/1/GRM188R61A226ME15_02A-1985787.pdf> GRM188R61E106MA73D <https://www.mouser.com/datasheet/2/281/1/GRM188R61E106MA73_01A-1985806.pdf> 885012006013 <https://www.mouser.com/datasheet/2/445/885012006013-1726946.pdf> 2220Y6300105KXTWS2 <https://www.mouser.com/datasheet/2/218/SMD_High_and_Std_StackiCap_P62-1825512.pdf> Yageo Class 2, X5R <https://www.mouser.com/datasheet/2/447/UPY_GPHC_X5R_4V_to_50V_26-1827097.pdf> TDK C Series <https://www.mouser.com/ProductDetail/TDK/C3216X5R1V226M160AC?qs=%2Fha2pyFadujbcx9jh7lYl%2F4NeMoXFhdc8AqVWNq4wW6M2y7zl6GzBuhgtI0ngznN> AVX Automotive MLCC <https://www.mouser.com/datasheet/2/40/AutoMLCC-777028.pdf> KEMET X7R Series <https://www.mouser.com/datasheet/2/212/KEM_C1002_X7R_SMD-1102033.pdf>; CAPACITANCE: 1µF; DKPN: 1276-1184-1-ND; MANUFACTURER: Samsung Electro-Mechanics; MOPN: 187-CL10B105KA8NNNC; MPN: CL10B105KA8NNNC; TOLERANCE: 10%; VOLTAGE: 25V
C7 = HyTechDevices - Copy:CAPACITOR_?_*: Capacitor, Non-Polarized VJ...1BC Series Datasheet <https://www.mouser.com/datasheet/2/427/vjw1bcbascomseries-1762447.pdf> Samsung Datasheet <https://www.mouser.com/datasheet/2/585/MLCC-1837944.pdf> Walsin Datasheet <https://www.mouser.com/datasheet/2/210/WTC_MLCC_General_Purpose-1534899.pdf> GRM188R61A226ME15D <https://www.mouser.com/datasheet/2/281/1/GRM188R61A226ME15_02A-1985787.pdf> GRM188R61E106MA73D <https://www.mouser.com/datasheet/2/281/1/GRM188R61E106MA73_01A-1985806.pdf> 885012006013 <https://www.mouser.com/datasheet/2/445/885012006013-1726946.pdf> 2220Y6300105KXTWS2 <https://www.mouser.com/datasheet/2/218/SMD_High_and_Std_StackiCap_P62-1825512.pdf> Yageo Class 2, X5R <https://www.mouser.com/datasheet/2/447/UPY_GPHC_X5R_4V_to_50V_26-1827097.pdf> TDK C Series <https://www.mouser.com/ProductDetail/TDK/C3216X5R1V226M160AC?qs=%2Fha2pyFadujbcx9jh7lYl%2F4NeMoXFhdc8AqVWNq4wW6M2y7zl6GzBuhgtI0ngznN> AVX Automotive MLCC <https://www.mouser.com/datasheet/2/40/AutoMLCC-777028.pdf> KEMET X7R Series <https://www.mouser.com/datasheet/2/212/KEM_C1002_X7R_SMD-1102033.pdf>; CAPACITANCE: 0.1µF; DKPN: 1276-1006-1-ND; MANUFACTURER: Samsung Electro-Mechanics; MOPN: 187-CL10B104KA8NNNC; MPN: CL10B104KA8NNNC; TOLERANCE: 10%; VOLTAGE: 25V
C8-C10 = HyTechDevices:CAPACITOR_?_*: Capacitor, Non-Polarized VJ...1BC Series Datasheet <https://www.mouser.com/datasheet/2/427/vjw1bcbascomseries-1762447.pdf> Samsung Datasheet <https://www.mouser.com/datasheet/2/585/MLCC-1837944.pdf> Walsin Datasheet <https://www.mouser.com/datasheet/2/210/WTC_MLCC_General_Purpose-1534899.pdf> GRM188R61A226ME15D <https://www.mouser.com/datasheet/2/281/1/GRM188R61A226ME15_02A-1985787.pdf> GRM188R61E106MA73D <https://www.mouser.com/datasheet/2/281/1/GRM188R61E106MA73_01A-1985806.pdf> 885012006013 <https://www.mouser.com/datasheet/2/445/885012006013-1726946.pdf> 2220Y6300105KXTWS2 <https://www.mouser.com/datasheet/2/218/SMD_High_and_Std_StackiCap_P62-1825512.pdf> Yageo Class 2, X5R <https://www.mouser.com/datasheet/2/447/UPY_GPHC_X5R_4V_to_50V_26-1827097.pdf> TDK C Series <https://www.mouser.com/ProductDetail/TDK/C3216X5R1V226M160AC?qs=%2Fha2pyFadujbcx9jh7lYl%2F4NeMoXFhdc8AqVWNq4wW6M2y7zl6GzBuhgtI0ngznN> AVX Automotive MLCC <https://www.mouser.com/datasheet/2/40/AutoMLCC-777028.pdf> KEMET X7R Series <https://www.mouser.com/datasheet/2/212/KEM_C1002_X7R_SMD-1102033.pdf>; CAPACITANCE: 0.1µF; DKPN: 1276-1006-1-ND; MANUFACTURER: Samsung Electro-Mechanics; MOPN: 187-CL10B104KA8NNNC; MPN: CL10B104KA8NNNC; TOLERANCE: 10%; VOLTAGE: 25V
C11-C13 C16 C20 C22-C27 C31 = HyTechDevices:CAPACITOR_?_*: Capacitor, Non-Polarized VJ...1BC Series Datasheet <https://www.mouser.com/datasheet/2/427/vjw1bcbascomseries-1762447.pdf> Samsung Datasheet <https://www.mouser.com/datasheet/2/585/MLCC-1837944.pdf> Walsin Datasheet <https://www.mouser.com/datasheet/2/210/WTC_MLCC_General_Purpose-1534899.pdf> GRM188R61A226ME15D <https://www.mouser.com/datasheet/2/281/1/GRM188R61A226ME15_02A-1985787.pdf> GRM188R61E106MA73D <https://www.mouser.com/datasheet/2/281/1/GRM188R61E106MA73_01A-1985806.pdf> 885012006013 <https://www.mouser.com/datasheet/2/445/885012006013-1726946.pdf> 2220Y6300105KXTWS2 <https://www.mouser.com/datasheet/2/218/SMD_High_and_Std_StackiCap_P62-1825512.pdf> Yageo Class 2, X5R <https://www.mouser.com/datasheet/2/447/UPY_GPHC_X5R_4V_to_50V_26-1827097.pdf> TDK C Series <https://www.mouser.com/ProductDetail/TDK/C3216X5R1V226M160AC?qs=%2Fha2pyFadujbcx9jh7lYl%2F4NeMoXFhdc8AqVWNq4wW6M2y7zl6GzBuhgtI0ngznN> AVX Automotive MLCC <https://www.mouser.com/datasheet/2/40/AutoMLCC-777028.pdf> KEMET X7R Series <https://www.mouser.com/datasheet/2/212/KEM_C1002_X7R_SMD-1102033.pdf>; CAPACITANCE: 0.1µF; DKPN: 720-1688-1-ND; MANUFACTURER: Vishay Vitramon; MOPN: 77-VJ0603Y104JXQPBC; MPN: VJ0603Y104JXQPW1BC; TOLERANCE: 5%; VOLTAGE: 10V
C14 C15 C18 C21 C28 C30 = HyTechDevices - Copy:CAPACITOR_?_*: Capacitor, Non-Polarized VJ...1BC Series Datasheet <https://www.mouser.com/datasheet/2/427/vjw1bcbascomseries-1762447.pdf> Samsung Datasheet <https://www.mouser.com/datasheet/2/585/MLCC-1837944.pdf> Walsin Datasheet <https://www.mouser.com/datasheet/2/210/WTC_MLCC_General_Purpose-1534899.pdf> GRM188R61A226ME15D <https://www.mouser.com/datasheet/2/281/1/GRM188R61A226ME15_02A-1985787.pdf> GRM188R61E106MA73D <https://www.mouser.com/datasheet/2/281/1/GRM188R61E106MA73_01A-1985806.pdf> 885012006013 <https://www.mouser.com/datasheet/2/445/885012006013-1726946.pdf> 2220Y6300105KXTWS2 <https://www.mouser.com/datasheet/2/218/SMD_High_and_Std_StackiCap_P62-1825512.pdf> Yageo Class 2, X5R <https://www.mouser.com/datasheet/2/447/UPY_GPHC_X5R_4V_to_50V_26-1827097.pdf> TDK C Series <https://www.mouser.com/ProductDetail/TDK/C3216X5R1V226M160AC?qs=%2Fha2pyFadujbcx9jh7lYl%2F4NeMoXFhdc8AqVWNq4wW6M2y7zl6GzBuhgtI0ngznN> AVX Automotive MLCC <https://www.mouser.com/datasheet/2/40/AutoMLCC-777028.pdf> KEMET X7R Series <https://www.mouser.com/datasheet/2/212/KEM_C1002_X7R_SMD-1102033.pdf>; CAPACITANCE: 0.1µF; DKPN: 720-1688-1-ND; MANUFACTURER: Vishay Vitramon; MOPN: 77-VJ0603Y104JXQPBC; MPN: VJ0603Y104JXQPW1BC; TOLERANCE: 5%; VOLTAGE: 10V
C17 C19 = HyTechDevices - Copy:CAPACITOR_?_*: Capacitor, Non-Polarized VJ...1BC Series Datasheet <https://www.mouser.com/datasheet/2/427/vjw1bcbascomseries-1762447.pdf> Samsung Datasheet <https://www.mouser.com/datasheet/2/585/MLCC-1837944.pdf> Walsin Datasheet <https://www.mouser.com/datasheet/2/210/WTC_MLCC_General_Purpose-1534899.pdf> GRM188R61A226ME15D <https://www.mouser.com/datasheet/2/281/1/GRM188R61A226ME15_02A-1985787.pdf> GRM188R61E106MA73D <https://www.mouser.com/datasheet/2/281/1/GRM188R61E106MA73_01A-1985806.pdf> 885012006013 <https://www.mouser.com/datasheet/2/445/885012006013-1726946.pdf> 2220Y6300105KXTWS2 <https://www.mouser.com/datasheet/2/218/SMD_High_and_Std_StackiCap_P62-1825512.pdf> Yageo Class 2, X5R <https://www.mouser.com/datasheet/2/447/UPY_GPHC_X5R_4V_to_50V_26-1827097.pdf> TDK C Series <https://www.mouser.com/ProductDetail/TDK/C3216X5R1V226M160AC?qs=%2Fha2pyFadujbcx9jh7lYl%2F4NeMoXFhdc8AqVWNq4wW6M2y7zl6GzBuhgtI0ngznN> AVX Automotive MLCC <https://www.mouser.com/datasheet/2/40/AutoMLCC-777028.pdf> KEMET X7R Series <https://www.mouser.com/datasheet/2/212/KEM_C1002_X7R_SMD-1102033.pdf>; CAPACITANCE: 750pF; DKPN: 311-4101-1-ND; MANUFACTURER: Yageo; MOPN: 603-CC0603KR9BB751; MPN: CC0603KRX7R9BB751; TOLERANCE: 10%; VOLTAGE: 50V
C29 = HyTechDevices - Copy:CAPACITOR_?_*: Capacitor, Non-Polarized VJ...1BC Series Datasheet <https://www.mouser.com/datasheet/2/427/vjw1bcbascomseries-1762447.pdf> Samsung Datasheet <https://www.mouser.com/datasheet/2/585/MLCC-1837944.pdf> Walsin Datasheet <https://www.mouser.com/datasheet/2/210/WTC_MLCC_General_Purpose-1534899.pdf> GRM188R61A226ME15D <https://www.mouser.com/datasheet/2/281/1/GRM188R61A226ME15_02A-1985787.pdf> GRM188R61E106MA73D <https://www.mouser.com/datasheet/2/281/1/GRM188R61E106MA73_01A-1985806.pdf> 885012006013 <https://www.mouser.com/datasheet/2/445/885012006013-1726946.pdf> 2220Y6300105KXTWS2 <https://www.mouser.com/datasheet/2/218/SMD_High_and_Std_StackiCap_P62-1825512.pdf> Yageo Class 2, X5R <https://www.mouser.com/datasheet/2/447/UPY_GPHC_X5R_4V_to_50V_26-1827097.pdf> TDK C Series <https://www.mouser.com/ProductDetail/TDK/C3216X5R1V226M160AC?qs=%2Fha2pyFadujbcx9jh7lYl%2F4NeMoXFhdc8AqVWNq4wW6M2y7zl6GzBuhgtI0ngznN> AVX Automotive MLCC <https://www.mouser.com/datasheet/2/40/AutoMLCC-777028.pdf> KEMET X7R Series <https://www.mouser.com/datasheet/2/212/KEM_C1002_X7R_SMD-1102033.pdf>; CAPACITANCE: 1µF; DKPN: 311-1796-1-ND; MANUFACTURER: Yageo; MOPN: 603-CC603KRX7R6BB105; MPN: CC0603KRX7R6BB105; TOLERANCE: 10%; VOLTAGE: 10V
C32 = HyTechDevices:CAPACITOR_?_*: Capacitor, Non-Polarized VJ...1BC Series Datasheet <https://www.mouser.com/datasheet/2/427/vjw1bcbascomseries-1762447.pdf> Samsung Datasheet <https://www.mouser.com/datasheet/2/585/MLCC-1837944.pdf> Walsin Datasheet <https://www.mouser.com/datasheet/2/210/WTC_MLCC_General_Purpose-1534899.pdf> GRM188R61A226ME15D <https://www.mouser.com/datasheet/2/281/1/GRM188R61A226ME15_02A-1985787.pdf> GRM188R61E106MA73D <https://www.mouser.com/datasheet/2/281/1/GRM188R61E106MA73_01A-1985806.pdf> 885012006013 <https://www.mouser.com/datasheet/2/445/885012006013-1726946.pdf> 2220Y6300105KXTWS2 <https://www.mouser.com/datasheet/2/218/SMD_High_and_Std_StackiCap_P62-1825512.pdf> Yageo Class 2, X5R <https://www.mouser.com/datasheet/2/447/UPY_GPHC_X5R_4V_to_50V_26-1827097.pdf> TDK C Series <https://www.mouser.com/ProductDetail/TDK/C3216X5R1V226M160AC?qs=%2Fha2pyFadujbcx9jh7lYl%2F4NeMoXFhdc8AqVWNq4wW6M2y7zl6GzBuhgtI0ngznN> AVX Automotive MLCC <https://www.mouser.com/datasheet/2/40/AutoMLCC-777028.pdf> KEMET X7R Series <https://www.mouser.com/datasheet/2/212/KEM_C1002_X7R_SMD-1102033.pdf>; CAPACITANCE: 1µF; DKPN: 311-1796-1-ND; MANUFACTURER: Yageo; MOPN: 603-CC603KRX7R6BB105; MPN: CC0603KRX7R6BB105; TOLERANCE: 10%; VOLTAGE: 10V
D1 = HyTechDevices:TVS_*: TVS Diode GSOT Datasheet <https://www.mouser.com/datasheet/2/427/gsot03-1767593.pdf>; DKPN: GSOT15-E3-08CT-ND; MANUFACTURER: Vishay General Semiconductor - Diodes Division; MOPN: 78-GSOT15-E3-08; MPN: GSOT15-E3-08; VOLTAGE: 15V
D2 = HyTechDevices - Copy:LED_?_*: LED Blue <https://www.mouser.com/datasheet/2/216/APT1608VBC_D-246010.pdf> Green <https://www.mouser.com/datasheet/2/216/APT1608ZGCK-1173388.pdf> Orange <https://www.mouser.com/datasheet/2/216/APT1608SECK-6197.pdf> Red <https://www.mouser.com/datasheet/2/216/APT1608SECK-J3-PRV-1173336.pdf> White <https://www.mouser.com/datasheet/2/50/SM0603UWC-880813.pdf> Yellow <https://www.mouser.com/datasheet/2/216/APT1608SYCK-J3-PRV-1173311.pdf>; COLOR: Blue; DKPN: 754-1789-1-ND; MANUFACTURER: Kingbright; MOPN: 604-APT1608VBC/D; MPN: APT1608VBC/D
D3 = HyTechDevices - Copy:LED_?_*: LED Blue <https://www.mouser.com/datasheet/2/216/APT1608VBC_D-246010.pdf> Green <https://www.mouser.com/datasheet/2/216/APT1608ZGCK-1173388.pdf> Orange <https://www.mouser.com/datasheet/2/216/APT1608SECK-6197.pdf> Red <https://www.mouser.com/datasheet/2/216/APT1608SECK-J3-PRV-1173336.pdf> White <https://www.mouser.com/datasheet/2/50/SM0603UWC-880813.pdf> Yellow <https://www.mouser.com/datasheet/2/216/APT1608SYCK-J3-PRV-1173311.pdf>; COLOR: Red; DKPN: 754-1786-1-ND; MANUFACTURER: Kingbright; MOPN: 604-APT1608SECKJ3PRV; MPN: APT1608SECK/J3-PRV
D4 = HyTechDevices - Copy:TVS_*: TVS Diode GSOT Datasheet <https://www.mouser.com/datasheet/2/427/gsot03-1767593.pdf>; DKPN: GSOT08C-E3-08CT-ND; MANUFACTURER: Vishay General Semiconductor - Diodes Division; MOPN: 78-GSOT08C-E3-08; MPN: GSOT08C-E3-08; VOLTAGE: 8V
D5 D7-D9 = HyTechDevices:SCHOTTKY: Schottky Rectifier Diode Datasheet <https://www.vishay.com/docs/85892/vsky20401608.pdf>; DKPN: 112-VSKY20401608-G4-08CT-ND; MANUFACTURER: Vishay General Semiconductor - Diodes Division; MOPN: 78-VSKY20401608G408; MPN: VSKY20401608-G4-08
D6 = HyTechDevices:LED_?_*: LED Blue <https://www.mouser.com/datasheet/2/216/APT1608VBC_D-246010.pdf> Green <https://www.mouser.com/datasheet/2/216/APT1608ZGCK-1173388.pdf> Orange <https://www.mouser.com/datasheet/2/216/APT1608SECK-6197.pdf> Red <https://www.mouser.com/datasheet/2/216/APT1608SECK-J3-PRV-1173336.pdf> White <https://www.mouser.com/datasheet/2/50/SM0603UWC-880813.pdf> Yellow <https://www.mouser.com/datasheet/2/216/APT1608SYCK-J3-PRV-1173311.pdf>; COLOR: Red; DKPN: 754-1786-1-ND; MANUFACTURER: Kingbright; MOPN: 604-APT1608SECKJ3PRV; MPN: APT1608SECK/J3-PRV
F1 = HyTechDevices - Copy:FUSE_?_*: Fuse 0885 Series <https://www.mouser.com/datasheet/2/240/Littelfuse_Fuse_885_Datasheet_pdf-1371443.pdf>; CURRENT: 2.0A; DKPN: F10988CT-ND; MANUFACTURER: Littelfuse Inc.; MOPN: 576-0885002.DR; MPN: 0885002.DR; VOLTAGE: 500V
J1 = HyTechDevices - Copy:CONNECTOR-CAN_?_*: HyTech CAN Connector; MANUFACTURER: Molex; MPN: 105429-1304
J2 = HyTechDevices - Copy:CONNECTOR-6_?_*: 6 Pin Connector; MANUFACTURER: MOLEX; MPN: 430450614
J3 = HyTechDevices - Copy:CONNECTOR-8_?_*: 8 Pin Connector; MANUFACTURER: MOLEX; MPN: 430450814
Q1 = HyTechDevices:TRANSISTOR_N_MOS_?_*: N-MOSFET PMV15ENEA Datasheet <https://www.mouser.com/datasheet/2/916/PMV15ENEA-1604828.pdf> TK6P65W Datasheet <https://www.mouser.com/datasheet/2/408/TK6P65W_datasheet_en_20151225-1916290.pdf> SIR638ADP Datasheet <https://www.mouser.com/datasheet/2/427/sir638adp-1766131.pdf>; DKPN: 1727-8588-1-ND; MANUFACTURER: Nexperia USA Inc.; MOPN: 771-PMV15ENEAR; MPN: PMV15ENEAR
R1 R3 R7 R8 R31 = HyTechDevices:RESISTOR_?_*: Resistor PWR163 Series <https://www.mouser.com/datasheet/2/54/pwr163-777985.pdf> AC Series <https://www.mouser.com/datasheet/2/447/Yageo_PYu_AC_51_RoHS_L_7_1714230-1874691.pdf> PU Series <https://www.mouser.com/datasheet/2/447/PYu-PU_51_RoHS_L_6-1504619.pdf> ERA Series <https://www.mouser.com/datasheet/2/315/AOA0000C307-1149632.pdf> PWR263 Series <https://www.mouser.com/datasheet/2/54/pwr263s_35-778069.pdf> RC Series <https://www.mouser.com/datasheet/2/447/Yageo_03_18_2021_PYu_RC_Group_51_RoHS_L_11-2199992.pdf> ERJ PB3, PB6 Series <https://www.mouser.com/datasheet/2/315/AOA0000C328-1530132.pdf> ERJ PA2, P03, PA3, P06, P08, P14 Series <https://www.mouser.com/datasheet/2/315/AOA0000C331-1141874.pdf>; DKPN: 311-1.00KHRCT-ND; MANUFACTURER: Yageo; MOPN: 603-RC0603FR-071KL; MPN: RC0603FR-071KL; POWER: 0.1W; RESISTANCE: 1k; TOLERANCE: 1%; VOLTAGE_CONTINUOUS: 10.00V; VOLTAGE_MAX: 75V
R2 = HyTechDevices:RESISTOR_?_*: Resistor PWR163 Series <https://www.mouser.com/datasheet/2/54/pwr163-777985.pdf> AC Series <https://www.mouser.com/datasheet/2/447/Yageo_PYu_AC_51_RoHS_L_7_1714230-1874691.pdf> PU Series <https://www.mouser.com/datasheet/2/447/PYu-PU_51_RoHS_L_6-1504619.pdf> ERA Series <https://www.mouser.com/datasheet/2/315/AOA0000C307-1149632.pdf> PWR263 Series <https://www.mouser.com/datasheet/2/54/pwr263s_35-778069.pdf> RC Series <https://www.mouser.com/datasheet/2/447/Yageo_03_18_2021_PYu_RC_Group_51_RoHS_L_11-2199992.pdf> ERJ PB3, PB6 Series <https://www.mouser.com/datasheet/2/315/AOA0000C328-1530132.pdf> ERJ PA2, P03, PA3, P06, P08, P14 Series <https://www.mouser.com/datasheet/2/315/AOA0000C331-1141874.pdf>; DKPN: P2.0KBDCT-ND; MANUFACTURER: Panasonic Electronic Components; MOPN: 667-ERA-3ARB202V; MPN: ERA-3ARB202V; POWER: 0.1W; RESISTANCE: 2k; TOLERANCE: 0.1%; VOLTAGE_CONTINUOUS: 14.14V; VOLTAGE_MAX: 75V
R4 R18 R22 R32 R40 = HyTechDevices:RESISTOR_?_*: Resistor PWR163 Series <https://www.mouser.com/datasheet/2/54/pwr163-777985.pdf> AC Series <https://www.mouser.com/datasheet/2/447/Yageo_PYu_AC_51_RoHS_L_7_1714230-1874691.pdf> PU Series <https://www.mouser.com/datasheet/2/447/PYu-PU_51_RoHS_L_6-1504619.pdf> ERA Series <https://www.mouser.com/datasheet/2/315/AOA0000C307-1149632.pdf> PWR263 Series <https://www.mouser.com/datasheet/2/54/pwr263s_35-778069.pdf> RC Series <https://www.mouser.com/datasheet/2/447/Yageo_03_18_2021_PYu_RC_Group_51_RoHS_L_11-2199992.pdf> ERJ PB3, PB6 Series <https://www.mouser.com/datasheet/2/315/AOA0000C328-1530132.pdf> ERJ PA2, P03, PA3, P06, P08, P14 Series <https://www.mouser.com/datasheet/2/315/AOA0000C331-1141874.pdf>; RESISTANCE: DNP
R5 R17 = HyTechDevices:RESISTOR_?_*: Resistor PWR163 Series <https://www.mouser.com/datasheet/2/54/pwr163-777985.pdf> AC Series <https://www.mouser.com/datasheet/2/447/Yageo_PYu_AC_51_RoHS_L_7_1714230-1874691.pdf> PU Series <https://www.mouser.com/datasheet/2/447/PYu-PU_51_RoHS_L_6-1504619.pdf> ERA Series <https://www.mouser.com/datasheet/2/315/AOA0000C307-1149632.pdf> PWR263 Series <https://www.mouser.com/datasheet/2/54/pwr263s_35-778069.pdf> RC Series <https://www.mouser.com/datasheet/2/447/Yageo_03_18_2021_PYu_RC_Group_51_RoHS_L_11-2199992.pdf> ERJ PB3, PB6 Series <https://www.mouser.com/datasheet/2/315/AOA0000C328-1530132.pdf> ERJ PA2, P03, PA3, P06, P08, P14 Series <https://www.mouser.com/datasheet/2/315/AOA0000C331-1141874.pdf>; DKPN: P4.12KDBCT-ND; MANUFACTURER: Panasonic Electronic Components; MOPN: 667-ERA-3AEB4121V; MPN: ERA-3AEB4121V; POWER: 0.1W; RESISTANCE: 4.12k; TOLERANCE: 0.1%; VOLTAGE_CONTINUOUS: 20.30V; VOLTAGE_MAX: 75V
R6 = HyTechDevices:RESISTOR_?_*: Resistor PWR163 Series <https://www.mouser.com/datasheet/2/54/pwr163-777985.pdf> AC Series <https://www.mouser.com/datasheet/2/447/Yageo_PYu_AC_51_RoHS_L_7_1714230-1874691.pdf> PU Series <https://www.mouser.com/datasheet/2/447/PYu-PU_51_RoHS_L_6-1504619.pdf> ERA Series <https://www.mouser.com/datasheet/2/315/AOA0000C307-1149632.pdf> PWR263 Series <https://www.mouser.com/datasheet/2/54/pwr263s_35-778069.pdf> RC Series <https://www.mouser.com/datasheet/2/447/Yageo_03_18_2021_PYu_RC_Group_51_RoHS_L_11-2199992.pdf> ERJ PB3, PB6 Series <https://www.mouser.com/datasheet/2/315/AOA0000C328-1530132.pdf> ERJ PA2, P03, PA3, P06, P08, P14 Series <https://www.mouser.com/datasheet/2/315/AOA0000C331-1141874.pdf>; DKPN: 311-43.0KHRCT-ND; MANUFACTURER: Yageo; MOPN: 603-RC0603FR-0743KL; MPN: RC0603FR-0743KL; POWER: 0.1W; RESISTANCE: 43k; TOLERANCE: 1%; VOLTAGE_CONTINUOUS: 65.57V; VOLTAGE_MAX: 75V
R9 R23 = HyTechDevices - Copy:RESISTOR_?_*: Resistor PWR163 Series <https://www.mouser.com/datasheet/2/54/pwr163-777985.pdf> AC Series <https://www.mouser.com/datasheet/2/447/Yageo_PYu_AC_51_RoHS_L_7_1714230-1874691.pdf> PU Series <https://www.mouser.com/datasheet/2/447/PYu-PU_51_RoHS_L_6-1504619.pdf> ERA Series <https://www.mouser.com/datasheet/2/315/AOA0000C307-1149632.pdf> PWR263 Series <https://www.mouser.com/datasheet/2/54/pwr263s_35-778069.pdf> RC Series <https://www.mouser.com/datasheet/2/447/Yageo_03_18_2021_PYu_RC_Group_51_RoHS_L_11-2199992.pdf> ERJ PB3, PB6 Series <https://www.mouser.com/datasheet/2/315/AOA0000C328-1530132.pdf> ERJ PA2, P03, PA3, P06, P08, P14 Series <https://www.mouser.com/datasheet/2/315/AOA0000C331-1141874.pdf>; DKPN: 311-10.0KHRCT-ND; MANUFACTURER: Yageo; MOPN: 603-RC0603FR-0710KL; MPN: RC0603FR-0710KL; POWER: 0.1W; RESISTANCE: 10k; TOLERANCE: 1%; VOLTAGE_CONTINUOUS: 31.62V; VOLTAGE_MAX: 75V
R10 R47 R50 = HyTechDevices - Copy:RESISTOR_?_*: Resistor PWR163 Series <https://www.mouser.com/datasheet/2/54/pwr163-777985.pdf> AC Series <https://www.mouser.com/datasheet/2/447/Yageo_PYu_AC_51_RoHS_L_7_1714230-1874691.pdf> PU Series <https://www.mouser.com/datasheet/2/447/PYu-PU_51_RoHS_L_6-1504619.pdf> ERA Series <https://www.mouser.com/datasheet/2/315/AOA0000C307-1149632.pdf> PWR263 Series <https://www.mouser.com/datasheet/2/54/pwr263s_35-778069.pdf> RC Series <https://www.mouser.com/datasheet/2/447/Yageo_03_18_2021_PYu_RC_Group_51_RoHS_L_11-2199992.pdf> ERJ PB3, PB6 Series <https://www.mouser.com/datasheet/2/315/AOA0000C328-1530132.pdf> ERJ PA2, P03, PA3, P06, P08, P14 Series <https://www.mouser.com/datasheet/2/315/AOA0000C331-1141874.pdf>; DKPN: 311-1.00KHRCT-ND; MANUFACTURER: Yageo; MOPN: 603-RC0603FR-071KL; MPN: RC0603FR-071KL; POWER: 0.1W; RESISTANCE: 1k; TOLERANCE: 1%; VOLTAGE_CONTINUOUS: 10.00V; VOLTAGE_MAX: 75V
R11 = HyTechDevices - Copy:RESISTOR_?_*: Resistor PWR163 Series <https://www.mouser.com/datasheet/2/54/pwr163-777985.pdf> AC Series <https://www.mouser.com/datasheet/2/447/Yageo_PYu_AC_51_RoHS_L_7_1714230-1874691.pdf> PU Series <https://www.mouser.com/datasheet/2/447/PYu-PU_51_RoHS_L_6-1504619.pdf> ERA Series <https://www.mouser.com/datasheet/2/315/AOA0000C307-1149632.pdf> PWR263 Series <https://www.mouser.com/datasheet/2/54/pwr263s_35-778069.pdf> RC Series <https://www.mouser.com/datasheet/2/447/Yageo_03_18_2021_PYu_RC_Group_51_RoHS_L_11-2199992.pdf> ERJ PB3, PB6 Series <https://www.mouser.com/datasheet/2/315/AOA0000C328-1530132.pdf> ERJ PA2, P03, PA3, P06, P08, P14 Series <https://www.mouser.com/datasheet/2/315/AOA0000C331-1141874.pdf>; DKPN: 311-2465-1-ND; MANUFACTURER: Yageo; MOPN: 603-RT0603DRE071K4L; MPN: RT0603DRE071K4L; POWER: 0.1W; RESISTANCE: 1.4K; TOLERANCE: 0.5%; VOLTAGE_CONTINUOUS: 75V; VOLTAGE_MAX: 75V
R12 R13 R46 R48 = HyTechDevices:RESISTOR_?_*: Resistor PWR163 Series <https://www.mouser.com/datasheet/2/54/pwr163-777985.pdf> AC Series <https://www.mouser.com/datasheet/2/447/Yageo_PYu_AC_51_RoHS_L_7_1714230-1874691.pdf> PU Series <https://www.mouser.com/datasheet/2/447/PYu-PU_51_RoHS_L_6-1504619.pdf> ERA Series <https://www.mouser.com/datasheet/2/315/AOA0000C307-1149632.pdf> PWR263 Series <https://www.mouser.com/datasheet/2/54/pwr263s_35-778069.pdf> RC Series <https://www.mouser.com/datasheet/2/447/Yageo_03_18_2021_PYu_RC_Group_51_RoHS_L_11-2199992.pdf> ERJ PB3, PB6 Series <https://www.mouser.com/datasheet/2/315/AOA0000C328-1530132.pdf> ERJ PA2, P03, PA3, P06, P08, P14 Series <https://www.mouser.com/datasheet/2/315/AOA0000C331-1141874.pdf>; DKPN: 311-10.0KHRCT-ND; MANUFACTURER: Yageo; MOPN: 603-RC0603FR-0710KL; MPN: RC0603FR-0710KL; POWER: 0.1W; RESISTANCE: 10k; TOLERANCE: 1%; VOLTAGE_CONTINUOUS: 31.62V; VOLTAGE_MAX: 75V
R14 R39 R44 = HyTechDevices - Copy:RESISTOR_?_*: Resistor PWR163 Series <https://www.mouser.com/datasheet/2/54/pwr163-777985.pdf> AC Series <https://www.mouser.com/datasheet/2/447/Yageo_PYu_AC_51_RoHS_L_7_1714230-1874691.pdf> PU Series <https://www.mouser.com/datasheet/2/447/PYu-PU_51_RoHS_L_6-1504619.pdf> ERA Series <https://www.mouser.com/datasheet/2/315/AOA0000C307-1149632.pdf> PWR263 Series <https://www.mouser.com/datasheet/2/54/pwr263s_35-778069.pdf> RC Series <https://www.mouser.com/datasheet/2/447/Yageo_03_18_2021_PYu_RC_Group_51_RoHS_L_11-2199992.pdf> ERJ PB3, PB6 Series <https://www.mouser.com/datasheet/2/315/AOA0000C328-1530132.pdf> ERJ PA2, P03, PA3, P06, P08, P14 Series <https://www.mouser.com/datasheet/2/315/AOA0000C331-1141874.pdf>; DKPN: 311-43.0KHRCT-ND; MANUFACTURER: Yageo; MOPN: 603-RC0603FR-0743KL; MPN: RC0603FR-0743KL; POWER: 0.1W; RESISTANCE: 43k; TOLERANCE: 1%; VOLTAGE_CONTINUOUS: 65.57V; VOLTAGE_MAX: 75V
R15 R30 = HyTechDevices - Copy:RESISTOR_?_*: Resistor PWR163 Series <https://www.mouser.com/datasheet/2/54/pwr163-777985.pdf> AC Series <https://www.mouser.com/datasheet/2/447/Yageo_PYu_AC_51_RoHS_L_7_1714230-1874691.pdf> PU Series <https://www.mouser.com/datasheet/2/447/PYu-PU_51_RoHS_L_6-1504619.pdf> ERA Series <https://www.mouser.com/datasheet/2/315/AOA0000C307-1149632.pdf> PWR263 Series <https://www.mouser.com/datasheet/2/54/pwr263s_35-778069.pdf> RC Series <https://www.mouser.com/datasheet/2/447/Yageo_03_18_2021_PYu_RC_Group_51_RoHS_L_11-2199992.pdf> ERJ PB3, PB6 Series <https://www.mouser.com/datasheet/2/315/AOA0000C328-1530132.pdf> ERJ PA2, P03, PA3, P06, P08, P14 Series <https://www.mouser.com/datasheet/2/315/AOA0000C331-1141874.pdf>; DKPN: 311-12.0KHRCT-ND; MANUFACTURER: Yageo; MOPN: 603-RC0603FR-0712KL; MPN: RC0603FR-0712KL; POWER: 0.1W; RESISTANCE: 12k; TOLERANCE: 1%; VOLTAGE_CONTINUOUS: 34.64V; VOLTAGE_MAX: 75V
R16 R19 = HyTechDevices:RESISTOR_?_*: Resistor PWR163 Series <https://www.mouser.com/datasheet/2/54/pwr163-777985.pdf> AC Series <https://www.mouser.com/datasheet/2/447/Yageo_PYu_AC_51_RoHS_L_7_1714230-1874691.pdf> PU Series <https://www.mouser.com/datasheet/2/447/PYu-PU_51_RoHS_L_6-1504619.pdf> ERA Series <https://www.mouser.com/datasheet/2/315/AOA0000C307-1149632.pdf> PWR263 Series <https://www.mouser.com/datasheet/2/54/pwr263s_35-778069.pdf> RC Series <https://www.mouser.com/datasheet/2/447/Yageo_03_18_2021_PYu_RC_Group_51_RoHS_L_11-2199992.pdf> ERJ PB3, PB6 Series <https://www.mouser.com/datasheet/2/315/AOA0000C328-1530132.pdf> ERJ PA2, P03, PA3, P06, P08, P14 Series <https://www.mouser.com/datasheet/2/315/AOA0000C331-1141874.pdf>; DKPN: P10.2KDBCT-ND; MANUFACTURER: Panasonic Electronic Components; MOPN: 667-ERA-3AEB1022V; MPN: ERA-3AEB1022V; POWER: 0.1W; RESISTANCE: 10.2k; TOLERANCE: 0.1%; VOLTAGE_CONTINUOUS: 31.94V; VOLTAGE_MAX: 75V
R20 R25-R29 R33 = HyTechDevices:RESISTOR_?_*: Resistor PWR163 Series <https://www.mouser.com/datasheet/2/54/pwr163-777985.pdf> AC Series <https://www.mouser.com/datasheet/2/447/Yageo_PYu_AC_51_RoHS_L_7_1714230-1874691.pdf> PU Series <https://www.mouser.com/datasheet/2/447/PYu-PU_51_RoHS_L_6-1504619.pdf> ERA Series <https://www.mouser.com/datasheet/2/315/AOA0000C307-1149632.pdf> PWR263 Series <https://www.mouser.com/datasheet/2/54/pwr263s_35-778069.pdf> RC Series <https://www.mouser.com/datasheet/2/447/Yageo_03_18_2021_PYu_RC_Group_51_RoHS_L_11-2199992.pdf> ERJ PB3, PB6 Series <https://www.mouser.com/datasheet/2/315/AOA0000C328-1530132.pdf> ERJ PA2, P03, PA3, P06, P08, P14 Series <https://www.mouser.com/datasheet/2/315/AOA0000C331-1141874.pdf>; DKPN: P11.5KDBCT-ND; MANUFACTURER: Panasonic Electronic Components; MOPN: 667-ERA-3AEB1152V; MPN: ERA-3AEB1152V; POWER: 0.1W; RESISTANCE: 11.5k; TOLERANCE: 0.1%; VOLTAGE_CONTINUOUS: 33.91V; VOLTAGE_MAX: 75V
R21 = HyTechDevices - Copy:RESISTOR_?_*: Resistor PWR163 Series <https://www.mouser.com/datasheet/2/54/pwr163-777985.pdf> AC Series <https://www.mouser.com/datasheet/2/447/Yageo_PYu_AC_51_RoHS_L_7_1714230-1874691.pdf> PU Series <https://www.mouser.com/datasheet/2/447/PYu-PU_51_RoHS_L_6-1504619.pdf> ERA Series <https://www.mouser.com/datasheet/2/315/AOA0000C307-1149632.pdf> PWR263 Series <https://www.mouser.com/datasheet/2/54/pwr263s_35-778069.pdf> RC Series <https://www.mouser.com/datasheet/2/447/Yageo_03_18_2021_PYu_RC_Group_51_RoHS_L_11-2199992.pdf> ERJ PB3, PB6 Series <https://www.mouser.com/datasheet/2/315/AOA0000C328-1530132.pdf> ERJ PA2, P03, PA3, P06, P08, P14 Series <https://www.mouser.com/datasheet/2/315/AOA0000C331-1141874.pdf>; DKPN: P360HCT-ND; MANUFACTURER: Panasonic Electronic Components; MOPN: 667-ERJ-3EKF3600V; MPN: ERJ-3EKF3600V; POWER: 0.1W; RESISTANCE: 360; TOLERANCE: 1%; VOLTAGE_CONTINUOUS: 75; VOLTAGE_MAX: 150
R24 = HyTechDevices:RESISTOR_?_*: Resistor PWR163 Series <https://www.mouser.com/datasheet/2/54/pwr163-777985.pdf> AC Series <https://www.mouser.com/datasheet/2/447/Yageo_PYu_AC_51_RoHS_L_7_1714230-1874691.pdf> PU Series <https://www.mouser.com/datasheet/2/447/PYu-PU_51_RoHS_L_6-1504619.pdf> ERA Series <https://www.mouser.com/datasheet/2/315/AOA0000C307-1149632.pdf> PWR263 Series <https://www.mouser.com/datasheet/2/54/pwr263s_35-778069.pdf> RC Series <https://www.mouser.com/datasheet/2/447/Yageo_03_18_2021_PYu_RC_Group_51_RoHS_L_11-2199992.pdf> ERJ PB3, PB6 Series <https://www.mouser.com/datasheet/2/315/AOA0000C328-1530132.pdf> ERJ PA2, P03, PA3, P06, P08, P14 Series <https://www.mouser.com/datasheet/2/315/AOA0000C331-1141874.pdf>; DKPN: P84.5KDBCT-ND; MANUFACTURER: Panasonic Electronic Components; MOPN: 667-ERA-3AEB8452V; MPN: ERA-3AEB8452V; POWER: 0.1W; RESISTANCE: 84.5k; TOLERANCE: 0.1%; VOLTAGE_CONTINUOUS: 75V; VOLTAGE_MAX: 75V
R34 = HyTechDevices - Copy:RESISTOR_?_*: Resistor PWR163 Series <https://www.mouser.com/datasheet/2/54/pwr163-777985.pdf> AC Series <https://www.mouser.com/datasheet/2/447/Yageo_PYu_AC_51_RoHS_L_7_1714230-1874691.pdf> PU Series <https://www.mouser.com/datasheet/2/447/PYu-PU_51_RoHS_L_6-1504619.pdf> ERA Series <https://www.mouser.com/datasheet/2/315/AOA0000C307-1149632.pdf> PWR263 Series <https://www.mouser.com/datasheet/2/54/pwr263s_35-778069.pdf> RC Series <https://www.mouser.com/datasheet/2/447/Yageo_03_18_2021_PYu_RC_Group_51_RoHS_L_11-2199992.pdf> ERJ PB3, PB6 Series <https://www.mouser.com/datasheet/2/315/AOA0000C328-1530132.pdf> ERJ PA2, P03, PA3, P06, P08, P14 Series <https://www.mouser.com/datasheet/2/315/AOA0000C331-1141874.pdf>; DKPN: P2.0KBDCT-ND; MANUFACTURER: Panasonic Electronic Components; MOPN: 667-ERA-3ARB202V; MPN: ERA-3ARB202V; POWER: 0.1W; RESISTANCE: 2k; TOLERANCE: 0.1%; VOLTAGE_CONTINUOUS: 14.14V; VOLTAGE_MAX: 75V
R35-R38 = HyTechDevices:RESISTOR_?_*: Resistor PWR163 Series <https://www.mouser.com/datasheet/2/54/pwr163-777985.pdf> AC Series <https://www.mouser.com/datasheet/2/447/Yageo_PYu_AC_51_RoHS_L_7_1714230-1874691.pdf> PU Series <https://www.mouser.com/datasheet/2/447/PYu-PU_51_RoHS_L_6-1504619.pdf> ERA Series <https://www.mouser.com/datasheet/2/315/AOA0000C307-1149632.pdf> PWR263 Series <https://www.mouser.com/datasheet/2/54/pwr263s_35-778069.pdf> RC Series <https://www.mouser.com/datasheet/2/447/Yageo_03_18_2021_PYu_RC_Group_51_RoHS_L_11-2199992.pdf> ERJ PB3, PB6 Series <https://www.mouser.com/datasheet/2/315/AOA0000C328-1530132.pdf> ERJ PA2, P03, PA3, P06, P08, P14 Series <https://www.mouser.com/datasheet/2/315/AOA0000C331-1141874.pdf>; DKPN: P10.5KDBCT-ND; MANUFACTURER: Panasonic Electronic Components; MOPN: 677-ERA-3AEB1052V; MPN: ERA-3AEB1052V; POWER: 0.1W; RESISTANCE: 10.5k; TOLERANCE: 0.1%; VOLTAGE_CONTINUOUS: 32.40V; VOLTAGE_MAX: 75V
R41 = HyTechDevices:RESISTOR_?_*: Resistor PWR163 Series <https://www.mouser.com/datasheet/2/54/pwr163-777985.pdf> AC Series <https://www.mouser.com/datasheet/2/447/Yageo_PYu_AC_51_RoHS_L_7_1714230-1874691.pdf> PU Series <https://www.mouser.com/datasheet/2/447/PYu-PU_51_RoHS_L_6-1504619.pdf> ERA Series <https://www.mouser.com/datasheet/2/315/AOA0000C307-1149632.pdf> PWR263 Series <https://www.mouser.com/datasheet/2/54/pwr263s_35-778069.pdf> RC Series <https://www.mouser.com/datasheet/2/447/Yageo_03_18_2021_PYu_RC_Group_51_RoHS_L_11-2199992.pdf> ERJ PB3, PB6 Series <https://www.mouser.com/datasheet/2/315/AOA0000C328-1530132.pdf> ERJ PA2, P03, PA3, P06, P08, P14 Series <https://www.mouser.com/datasheet/2/315/AOA0000C331-1141874.pdf>; DKPN: P215KDBCT-ND; MANUFACTURER: Panasonic Electronic Components; MOPN: 667-ERA-3AEB2153V; MPN: ERA-3AEB2153V; POWER: 0.1W; RESISTANCE: 215k; TOLERANCE: 0.1%; VOLTAGE_CONTINUOUS: 75V; VOLTAGE_MAX: 75V
R42 = HyTechDevices:RESISTOR_?_*: Resistor PWR163 Series <https://www.mouser.com/datasheet/2/54/pwr163-777985.pdf> AC Series <https://www.mouser.com/datasheet/2/447/Yageo_PYu_AC_51_RoHS_L_7_1714230-1874691.pdf> PU Series <https://www.mouser.com/datasheet/2/447/PYu-PU_51_RoHS_L_6-1504619.pdf> ERA Series <https://www.mouser.com/datasheet/2/315/AOA0000C307-1149632.pdf> PWR263 Series <https://www.mouser.com/datasheet/2/54/pwr263s_35-778069.pdf> RC Series <https://www.mouser.com/datasheet/2/447/Yageo_03_18_2021_PYu_RC_Group_51_RoHS_L_11-2199992.pdf> ERJ PB3, PB6 Series <https://www.mouser.com/datasheet/2/315/AOA0000C328-1530132.pdf> ERJ PA2, P03, PA3, P06, P08, P14 Series <https://www.mouser.com/datasheet/2/315/AOA0000C331-1141874.pdf>; DKPN: P11.3KDBCT-ND; MANUFACTURER: Panasonic Electronic Components; MOPN: 667-ERA-3AEB1132V; MPN: ERA-3AEB1132V; POWER: 0.1W; RESISTANCE: 11.3k; TOLERANCE: 0.1%; VOLTAGE_CONTINUOUS: 33.62V; VOLTAGE_MAX: 75V
R43 R45 = HyTechDevices - Copy:RESISTOR_?_*: Resistor PWR163 Series <https://www.mouser.com/datasheet/2/54/pwr163-777985.pdf> AC Series <https://www.mouser.com/datasheet/2/447/Yageo_PYu_AC_51_RoHS_L_7_1714230-1874691.pdf> PU Series <https://www.mouser.com/datasheet/2/447/PYu-PU_51_RoHS_L_6-1504619.pdf> ERA Series <https://www.mouser.com/datasheet/2/315/AOA0000C307-1149632.pdf> PWR263 Series <https://www.mouser.com/datasheet/2/54/pwr263s_35-778069.pdf> RC Series <https://www.mouser.com/datasheet/2/447/Yageo_03_18_2021_PYu_RC_Group_51_RoHS_L_11-2199992.pdf> ERJ PB3, PB6 Series <https://www.mouser.com/datasheet/2/315/AOA0000C328-1530132.pdf> ERJ PA2, P03, PA3, P06, P08, P14 Series <https://www.mouser.com/datasheet/2/315/AOA0000C331-1141874.pdf>; DKPN: P30KBDCT-ND; MANUFACTURER: Panasonic Electronic Components; MOPN: 667-ERA-3ARB303V; MPN: ERA-3ARB303V; POWER: 0.1W; RESISTANCE: 30k; TOLERANCE: 0.1%; VOLTAGE_CONTINUOUS: 54.77V; VOLTAGE_MAX: 75V
R49 = HyTechDevices:RESISTOR_?_*: Resistor PWR163 Series <https://www.mouser.com/datasheet/2/54/pwr163-777985.pdf> AC Series <https://www.mouser.com/datasheet/2/447/Yageo_PYu_AC_51_RoHS_L_7_1714230-1874691.pdf> PU Series <https://www.mouser.com/datasheet/2/447/PYu-PU_51_RoHS_L_6-1504619.pdf> ERA Series <https://www.mouser.com/datasheet/2/315/AOA0000C307-1149632.pdf> PWR263 Series <https://www.mouser.com/datasheet/2/54/pwr263s_35-778069.pdf> RC Series <https://www.mouser.com/datasheet/2/447/Yageo_03_18_2021_PYu_RC_Group_51_RoHS_L_11-2199992.pdf> ERJ PB3, PB6 Series <https://www.mouser.com/datasheet/2/315/AOA0000C328-1530132.pdf> ERJ PA2, P03, PA3, P06, P08, P14 Series <https://www.mouser.com/datasheet/2/315/AOA0000C331-1141874.pdf>; DKPN: 311-10.0HRCT-ND; MANUFACTURER: Yageo; MOPN: 603-RC0603FR-0710RL; MPN: RC0603FR-0710RL; POWER: 0.1W; RESISTANCE: 10; TOLERANCE: 1%; VOLTAGE_CONTINUOUS: 1V; VOLTAGE_MAX: 75V
T1 = HyTechDevices - Copy:TRANSFORMER: 2 Channel SMT Transformer Specs for both HM2102NL and HM2112ZNL Transformers Turns ratio: 1CT: 1CT Isolation Voltage: 4300 VDC Inductance: 150 uH Leakage Inductance: 0.50 uH max HM2102NLT: DataSheet <https://www.mouser.com/datasheet/2/336/HM2102NL-1218600.pdf> HM2112ZNLT: DataSheet <https://www.mouser.com/datasheet/2/336/HM2112ZNL-1224892.pdf>; DKPN: 1840-1036-1-ND; MANUFACTURER: Pulse Electronics; MOPN: 673-HM2112ZNLT; MPN: HM2112ZNLT
TP1-TP5 = HyTechDevices - Copy:TEST_POINT: Test Point; DKPN: 36-5015CT-ND; MANUFACTURER: Keystone Electronics; MOPN: 534-5015; MPN: 5015
U1 = HyTechDevices:VOLTAGE_REGULATOR_?_*: Voltage Regulators LDL1117S50R Datasheet <https://www.mouser.com/datasheet/2/389/dm00366442-1799212.pdf> NCP785AH120T1G <https://www.mouser.com/datasheet/2/308/NCP785A_D-1812704.pdf>; DKPN: NCP785AH120T1GOSCT-ND; MANUFACTURER: ON Semiconductor; MOPN: 863-NCP785AH120T1G; MPN: NCP785AH120T1G
U2 = HyTechDevices:ADG1423: ADG1423 Form-A/Form-C Analog Switch Datasheet <https://www.mouser.com/datasheet/2/609/ADG1421_1422_1423-1502752.pdf>; DKPN: ADG1423BRMZ-REEL7CT-ND; MANUFACTURER: Analog Devices Inc.; MOPN: 584-ADG1423BRMZ; MPN: ADG1423BRMZ
U3 = HyTechDevices:*555: **555 Precision Timer NA555, NE555, SA555, SE555 <https://www.ti.com/lit/ds/symlink/na555.pdf> LM555 <https://www.ti.com/lit/ds/symlink/lm555.pdf>; DKPN: LM555CMX/NOPBCT-ND; MANUFACTURER: Texas Instruments; MOPN: 926-LM555CMX/NOPB; MPN: LM555CMX/NOPB
U4 U7 U9 U10 U12-U14 U16-U18 = HyTechDevices:OPAMP_1_CHANNEL_*: Op-Amp 1 Channel OPA991 Datasheet <https://www.ti.com/lit/ds/symlink/opa991.pdf?ts=1615503614502> Note: OPA991 is also a comparator; MPN: OPA991IDCKT
U5 U6 = HyTechDevices:MAX74*: 8th-Order Maxim Filter MAX7480 Datasheet <https://www.mouser.com/datasheet/2/256/MAX7480-1515905.pdf> MAX7400 Datsheet <https://www.mouser.com/datasheet/2/256/MAX7404-1514314.pdf> MAX7400, 7404 uses a 680 pF clock capcitor; DKPN: MAX7400CSA+-ND; MANUFACTURER: Maxim Integrated; MOPN: 700-MAX7400CSA; MPN: MAX7400CSA+
U8 U11 U15 = HyTechDevices:LOGICGATE_AND_: AND Gate SN74LVC Datasheet <https://www.ti.com/lit/ds/symlink/sn74lvc1g08.pdf>; DKPN: 296-SN74LVC1G08DCK3TR-ND; MANUFACTURER: Texas Instruments; MOPN: 595-SN74LVC1G08DCK3; MPN: SN74LVC1G08DCK3
U19 = HyTechDevices - Copy:ADC128S022: ADC128S022 8-channel Analog to Digital Converter Datasheet <https://www.ti.com/lit/ds/symlink/adc128s022.pdf?ts=1609290895378&ref_url=https%253A%252F%252Fwww.ti.com%252Fproduct%252FADC128S022%253Fqgpn%253Dadc128s022>; DKPN: 296-38561-1-ND; MANUFACTURER: Texas Instruments; MOPN: 926-A128S022CIMTXNPB; MPN: ADC128S022CIMTX/NOPB
U24 = HyTechDevices:ADM823: ADM823 Watchdog Datasheet <https://www.mouser.com/datasheet/2/609/ADM823_824_825-1503117.pdf>; DKPN: 505-ADM823TYKSZ-R7CT-ND; MANUFACTURER: Analog Devices Inc.; MOPN: 584-ADM823TYKSZ-R7; MPN: ADM823TYKSZ-R7; RESET_VOLTAGE: 3.08
U25 = HyTechDevices:TCAN1051*V-Q1: TCAN1051*V Can Tranciever Datasheet <https://www.ti.com/lit/ds/symlink/tcan1051hgv-q1.pdf?HQS=dis-mous-null-mousermode-dsf-pf-null-wwe&ts=1610765132518&ref_url=https%253A%252F%252Fwww.mouser.com%252Ff>; DKPN: 296-49935-1-ND; MANUFACTURER: Texas Instruments; MOPN: 595-TCAN1051HGVDQ1; MPN: TCAN1051HGVDRQ1
U$1 = HyTechDevices - Copy:CONNECTOR-10_?_*: 10 pin connector; MANUFACTURER: MOLEX; MPN: 430451014
U$2 = HyTechDevices - Copy:CONNECTOR-12_?_*: 12 pin connector; MANUFACTURER: MOLEX; MPN: 430451214
U$5 = HyTechDevices - Copy:LTC6820: LTC6820 isoSPI Isolated Communications Interface Datasheet <mouser.com/datasheet/2/609/LTC6820-1601976.pdf>
U$9 U$10 = HyTechDevices:RELAY_SOLIDSTATE_NO: AQY214EH Normally Open Solid State Relay Datasheet <https://datasheetspdf.com/pdf-file/829078/Panasonic/AQY214EHA/1>; DKPN: 255-1436-5-ND; MANUFACTURER: Panasonic Electric Works; MOPN: 769-AQY214EHA; MPN: AQY214EHA